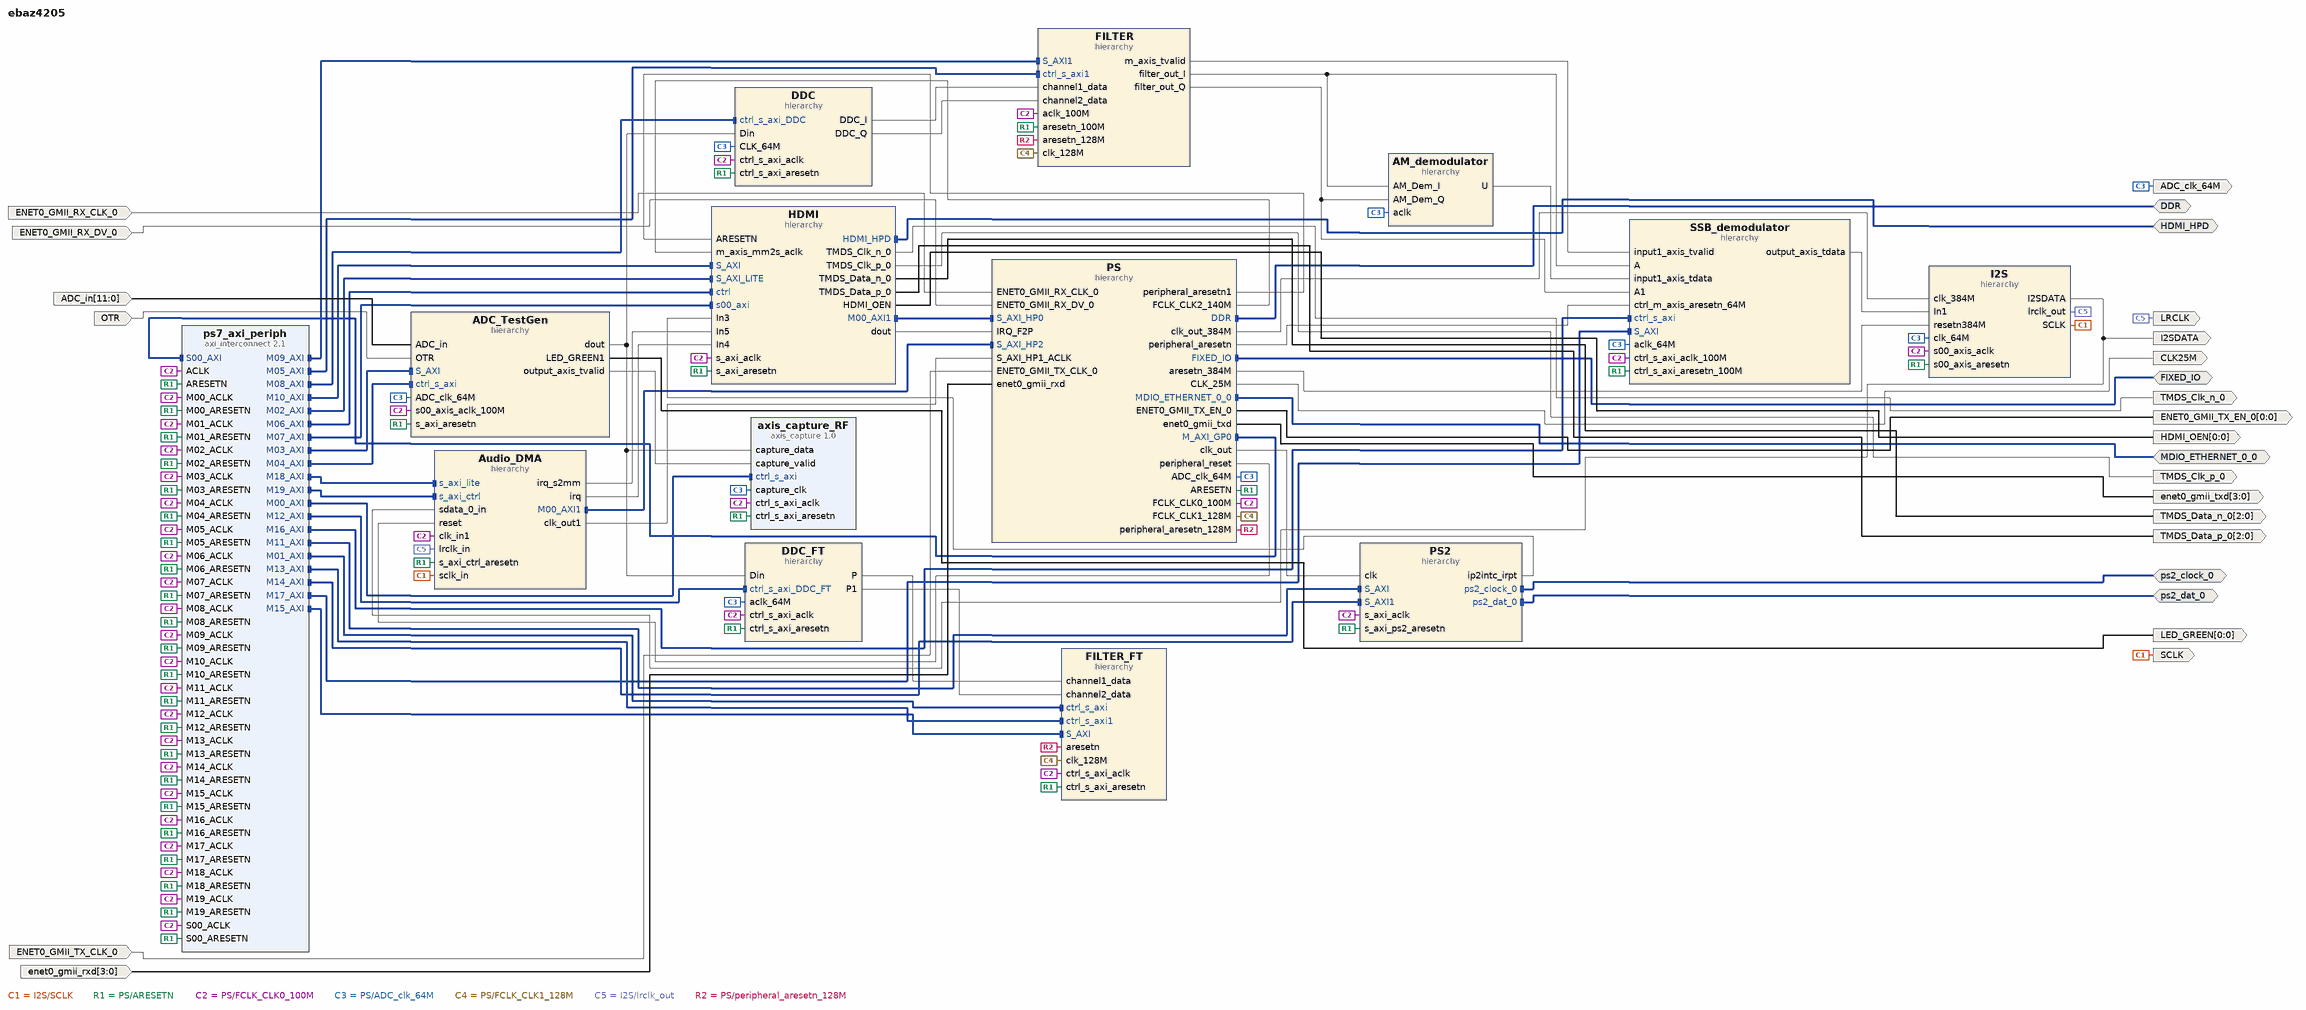
[diagram p0: block diagram of the top level]
# Vivado block design ebaz4205, xc7z010clg400-1, Vivado 2022.2
create_bd_design ebaz4205

create_bd_intf_port -mode Master -vlnv xilinx.com:interface:ddrx_rtl:1.0 DDR
create_bd_intf_port -mode Master -vlnv xilinx.com:display_processing_system7:fixedio_rtl:1.0 FIXED_IO
create_bd_intf_port -mode Master -vlnv xilinx.com:interface:mdio_rtl:1.0 MDIO_ETHERNET_0_0
create_bd_intf_port -mode Master -vlnv xilinx.com:interface:gpio_rtl:1.0 HDMI_HPD
create_bd_intf_port -mode Master -vlnv xilinx.com:interface:gpio_rtl:1.0 ps2_clock_0
create_bd_intf_port -mode Master -vlnv xilinx.com:interface:gpio_rtl:1.0 ps2_dat_0
create_bd_port -dir I -type clk ENET0_GMII_RX_CLK_0
create_bd_port -dir I ENET0_GMII_RX_DV_0
create_bd_port -dir I -type clk ENET0_GMII_TX_CLK_0
create_bd_port -dir O -from 0 -to 0 ENET0_GMII_TX_EN_0
create_bd_port -dir I -from 3 -to 0 enet0_gmii_rxd
create_bd_port -dir O -from 3 -to 0 enet0_gmii_txd
create_bd_port -dir O -type clk CLK25M
set_property -dict {CONFIG.FREQ_HZ 25000000} [get_bd_ports CLK25M]
create_bd_port -dir O -type clk ADC_clk_64M
set_property -dict {CONFIG.FREQ_HZ 64000000} [get_bd_ports ADC_clk_64M]
create_bd_port -dir I -type data OTR
create_bd_port -dir I -from 11 -to 0 -type data ADC_in
create_bd_port -dir O SCLK
create_bd_port -dir O LRCLK
create_bd_port -dir O I2SDATA
create_bd_port -dir O -from 0 -to 0 -type data LED_GREEN
create_bd_port -dir O -from 0 -to 0 HDMI_OEN
create_bd_port -dir O TMDS_Clk_p_0
create_bd_port -dir O TMDS_Clk_n_0
create_bd_port -dir O -from 2 -to 0 TMDS_Data_p_0
create_bd_port -dir O -from 2 -to 0 TMDS_Data_n_0

create_bd_cell -type hier PS
create_bd_cell -type hier ADC_TestGen
create_bd_cell -type hier DDC
create_bd_cell -type hier AM_demodulator
create_bd_cell -type hier FILTER
create_bd_cell -type hier I2S
create_bd_cell -type hier HDMI
create_bd_cell -type ip -vlnv xilinx.com:ip:axi_interconnect:2.1 ps7_axi_periph
set_property -dict [list \
  CONFIG.ENABLE_ADVANCED_OPTIONS 0 \
  CONFIG.NUM_MI 20 \
  CONFIG.NUM_SI 1 \
  CONFIG.STRATEGY 1 \
] [get_bd_cells ps7_axi_periph]
create_bd_cell -type hier DDC_FT
create_bd_cell -type hier FILTER_FT
create_bd_cell -type hier PS2
create_bd_cell -type ip -vlnv xilinx.com:user:axis_capture:1.0 axis_capture_RF
set_property -dict {CONFIG.C_CAPTURE_NUM_WORDS_EXP2 14} [get_bd_cells axis_capture_RF]
create_bd_cell -type hier SSB_demodulator
create_bd_cell -type hier Audio_DMA

# ---- hierarchy /PS ----
current_bd_instance /PS
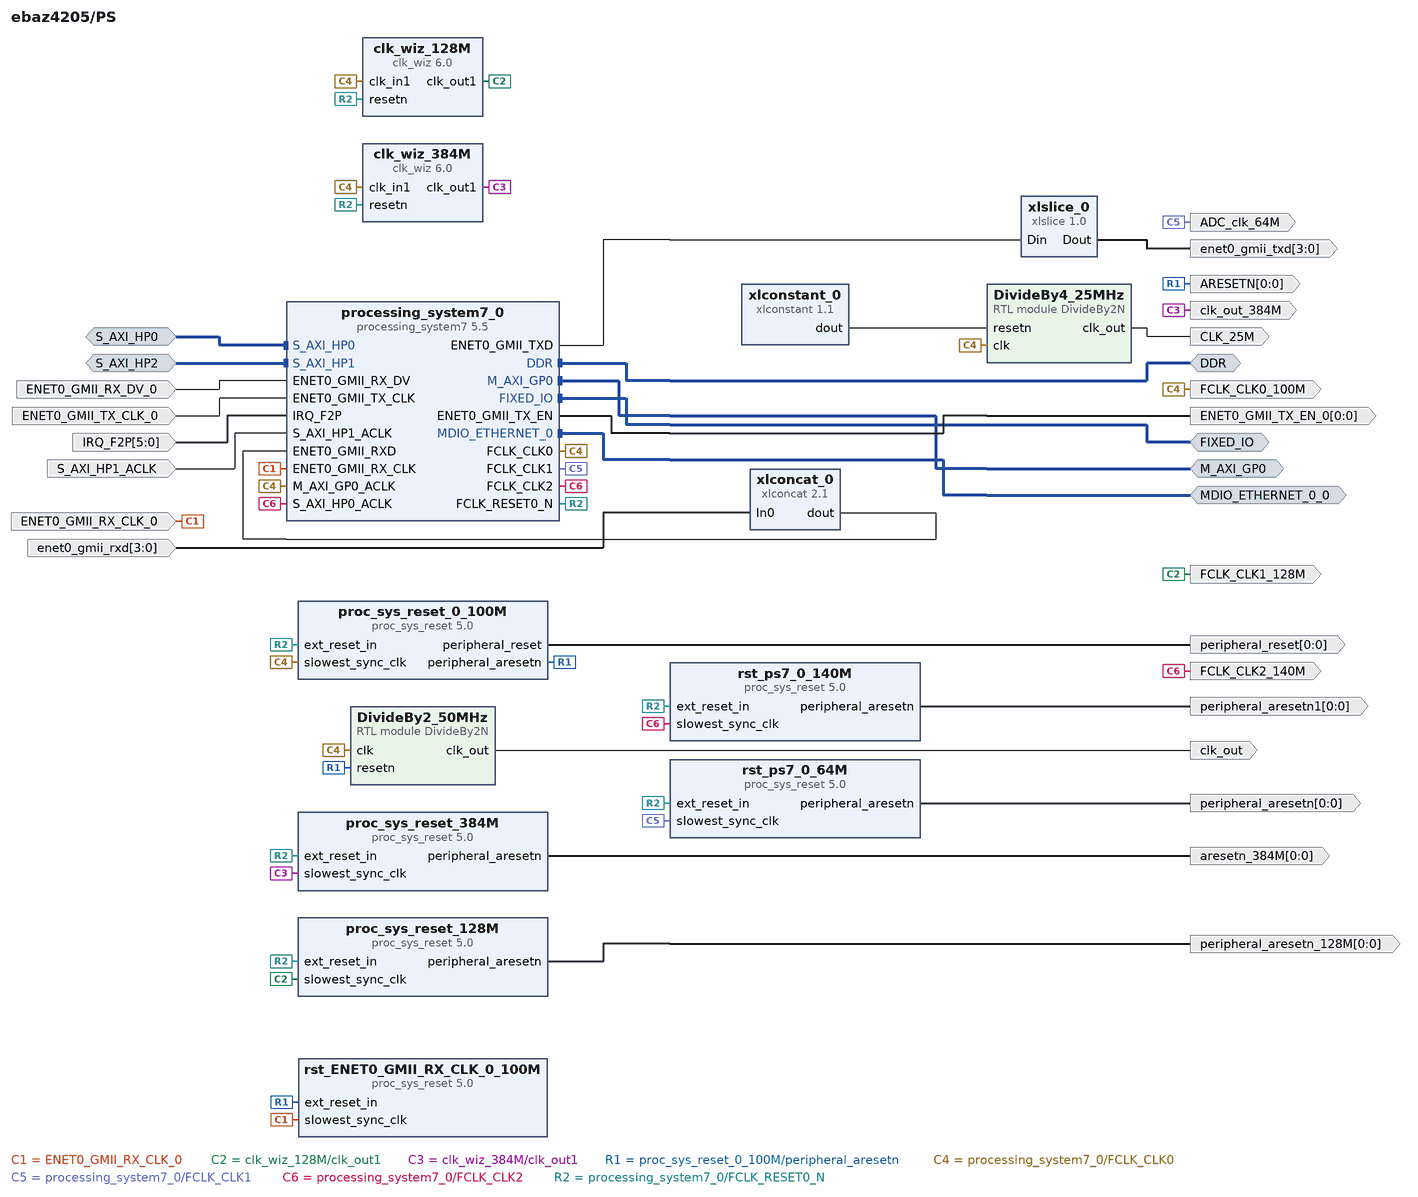
[diagram p1: block diagram inside /PS]
create_bd_intf_pin -mode Master -vlnv xilinx.com:interface:mdio_rtl:1.0 MDIO_ETHERNET_0_0
create_bd_intf_pin -mode Master -vlnv xilinx.com:interface:ddrx_rtl:1.0 DDR
create_bd_intf_pin -mode Master -vlnv xilinx.com:display_processing_system7:fixedio_rtl:1.0 FIXED_IO
create_bd_intf_pin -mode Slave -vlnv xilinx.com:interface:aximm_rtl:1.0 S_AXI_HP0
create_bd_intf_pin -mode Master -vlnv xilinx.com:interface:aximm_rtl:1.0 M_AXI_GP0
create_bd_intf_pin -mode Slave -vlnv xilinx.com:interface:aximm_rtl:1.0 S_AXI_HP2
create_bd_pin -dir O -from 0 -to 0 ENET0_GMII_TX_EN_0
create_bd_pin -dir I -type clk ENET0_GMII_RX_CLK_0
create_bd_pin -dir I ENET0_GMII_RX_DV_0
create_bd_pin -dir I -type clk ENET0_GMII_TX_CLK_0
create_bd_pin -dir O -type clk FCLK_CLK0_100M
create_bd_pin -dir O -type clk CLK_25M
create_bd_pin -dir O -from 3 -to 0 enet0_gmii_txd
create_bd_pin -dir O -from 0 -to 0 -type rst ARESETN
create_bd_pin -dir I -from 3 -to 0 enet0_gmii_rxd
create_bd_pin -dir O -type clk FCLK_CLK1_128M
create_bd_pin -dir O -from 0 -to 0 -type rst peripheral_reset
create_bd_pin -dir O -from 0 -to 0 -type rst peripheral_aresetn_128M
create_bd_pin -dir O -type clk FCLK_CLK2_140M
create_bd_pin -dir O -from 0 -to 0 -type rst peripheral_aresetn1
create_bd_pin -dir I -from 5 -to 0 -type intr IRQ_F2P
create_bd_pin -dir O ADC_clk_64M
create_bd_pin -dir O -from 0 -to 0 -type rst peripheral_aresetn
create_bd_pin -dir O clk_out
create_bd_pin -dir I -type clk S_AXI_HP1_ACLK
create_bd_pin -dir O -type clk clk_out_384M
create_bd_pin -dir O -from 0 -to 0 -type rst aresetn_384M

create_bd_cell -type ip -vlnv xilinx.com:ip:xlslice:1.0 xlslice_0
set_property -dict {CONFIG.DIN_FROM 3 CONFIG.DIN_TO 0 CONFIG.DIN_WIDTH 8 CONFIG.DOUT_WIDTH 4} [get_bd_cells xlslice_0]
create_bd_cell -type ip -vlnv xilinx.com:ip:xlconcat:2.1 xlconcat_0
set_property -dict {CONFIG.IN0_WIDTH 4 CONFIG.IN1_WIDTH 4 CONFIG.NUM_PORTS 2} [get_bd_cells xlconcat_0]
create_bd_cell -type ip -vlnv xilinx.com:ip:xlconstant:1.1 xlconstant_0
create_bd_cell -type module -reference DivideBy2N DivideBy4_25MHz
set_property -dict {CONFIG.N 2 CONFIG.WIDTH 2} [get_bd_cells DivideBy4_25MHz]
create_bd_cell -type module -reference DivideBy2N DivideBy2_50MHz
set_property -dict {CONFIG.N 1 CONFIG.WIDTH 2} [get_bd_cells DivideBy2_50MHz]
create_bd_cell -type ip -vlnv xilinx.com:ip:clk_wiz:6.0 clk_wiz_128M
set_property -dict [list \
  CONFIG.CLKIN1_JITTER_PS 100.0 \
  CONFIG.CLKOUT1_DRIVES BUFG \
  CONFIG.CLKOUT1_JITTER 181.719 \
  CONFIG.CLKOUT1_PHASE_ERROR 320.726 \
  CONFIG.CLKOUT1_REQUESTED_OUT_FREQ 128 \
  CONFIG.CLKOUT2_DRIVES BUFG \
  CONFIG.CLKOUT3_DRIVES BUFG \
  CONFIG.CLKOUT4_DRIVES BUFG \
  CONFIG.CLKOUT5_DRIVES BUFG \
  CONFIG.CLKOUT6_DRIVES BUFG \
  CONFIG.CLKOUT7_DRIVES BUFG \
  CONFIG.MMCM_BANDWIDTH OPTIMIZED \
  CONFIG.MMCM_CLKFBOUT_MULT_F 64 \
  CONFIG.MMCM_CLKIN1_PERIOD 10.000 \
  CONFIG.MMCM_CLKIN2_PERIOD 10.000 \
  CONFIG.MMCM_CLKOUT0_DIVIDE_F 10 \
  CONFIG.MMCM_COMPENSATION ZHOLD \
  CONFIG.MMCM_DIVCLK_DIVIDE 5 \
  CONFIG.PRIMITIVE PLL \
  CONFIG.PRIM_IN_FREQ 100 \
  CONFIG.RESET_PORT resetn \
  CONFIG.RESET_TYPE ACTIVE_LOW \
] [get_bd_cells clk_wiz_128M]
create_bd_cell -type ip -vlnv xilinx.com:ip:proc_sys_reset:5.0 proc_sys_reset_0_100M
create_bd_cell -type ip -vlnv xilinx.com:ip:proc_sys_reset:5.0 proc_sys_reset_128M
create_bd_cell -type ip -vlnv xilinx.com:ip:processing_system7:5.5 processing_system7_0
set_property -dict [list \
  CONFIG.PCW_APU_PERIPHERAL_FREQMHZ 666.666666 \
  CONFIG.PCW_ENET0_ENET0_IO EMIO \
  CONFIG.PCW_ENET0_GRP_MDIO_ENABLE 1 \
  CONFIG.PCW_ENET0_GRP_MDIO_IO EMIO \
  CONFIG.PCW_ENET0_PERIPHERAL_ENABLE 1 \
  CONFIG.PCW_ENET0_PERIPHERAL_FREQMHZ {100 Mbps} \
  CONFIG.PCW_ENET0_RESET_ENABLE 0 \
  CONFIG.PCW_ENET_RESET_ENABLE 1 \
  CONFIG.PCW_ENET_RESET_SELECT {Share reset pin} \
  CONFIG.PCW_EN_CLK1_PORT 1 \
  CONFIG.PCW_EN_CLK2_PORT 1 \
  CONFIG.PCW_EN_CLK3_PORT 1 \
  CONFIG.PCW_FCLK_CLK1_BUF TRUE \
  CONFIG.PCW_FCLK_CLK2_BUF TRUE \
  CONFIG.PCW_FCLK_CLK3_BUF TRUE \
  CONFIG.PCW_FPGA0_PERIPHERAL_FREQMHZ 100 \
  CONFIG.PCW_FPGA1_PERIPHERAL_FREQMHZ 64 \
  CONFIG.PCW_FPGA2_PERIPHERAL_FREQMHZ 142 \
  CONFIG.PCW_FPGA3_PERIPHERAL_FREQMHZ 25 \
  CONFIG.PCW_FPGA_FCLK1_ENABLE 1 \
  CONFIG.PCW_FPGA_FCLK2_ENABLE 1 \
  CONFIG.PCW_FPGA_FCLK3_ENABLE 1 \
  CONFIG.PCW_GPIO_EMIO_GPIO_ENABLE 1 \
  CONFIG.PCW_GPIO_EMIO_GPIO_IO 64 \
  CONFIG.PCW_GPIO_MIO_GPIO_ENABLE 1 \
  CONFIG.PCW_GPIO_MIO_GPIO_IO MIO \
  CONFIG.PCW_I2C_RESET_ENABLE 1 \
  CONFIG.PCW_IRQ_F2P_INTR 1 \
  CONFIG.PCW_NAND_NAND_IO {MIO 0 2.. 14} \
  CONFIG.PCW_NAND_PERIPHERAL_ENABLE 1 \
  CONFIG.PCW_PERIPHERAL_BOARD_PRESET part0 \
  CONFIG.PCW_PRESET_BANK1_VOLTAGE {LVCMOS 3.3V} \
  CONFIG.PCW_SD0_GRP_CD_ENABLE 1 \
  CONFIG.PCW_SD0_GRP_CD_IO {MIO 34} \
  CONFIG.PCW_SD0_GRP_WP_ENABLE 0 \
  CONFIG.PCW_SD0_PERIPHERAL_ENABLE 1 \
  CONFIG.PCW_SD0_SD0_IO {MIO 40 .. 45} \
  CONFIG.PCW_SDIO_PERIPHERAL_FREQMHZ 25 \
  CONFIG.PCW_UART1_PERIPHERAL_ENABLE 1 \
  CONFIG.PCW_UART1_UART1_IO {MIO 24 .. 25} \
  CONFIG.PCW_UART_PERIPHERAL_FREQMHZ 100 \
  CONFIG.PCW_UIPARAM_DDR_BUS_WIDTH {16 Bit} \
  CONFIG.PCW_UIPARAM_DDR_FREQ_MHZ 533.333333 \
  CONFIG.PCW_UIPARAM_DDR_PARTNO {MT41K128M16 JT-125} \
  CONFIG.PCW_USB0_PERIPHERAL_ENABLE 0 \
  CONFIG.PCW_USB_RESET_ENABLE 1 \
  CONFIG.PCW_USE_FABRIC_INTERRUPT 1 \
  CONFIG.PCW_USE_S_AXI_HP0 1 \
  CONFIG.PCW_USE_S_AXI_HP1 1 \
  CONFIG.preset None \
] [get_bd_cells processing_system7_0]
# 502 more settings of processing_system7_0 are not shown: defaults, MIO pin electricals, DDR timing, and values the tool derives
create_bd_cell -type ip -vlnv xilinx.com:ip:proc_sys_reset:5.0 rst_ENET0_GMII_RX_CLK_0_100M
create_bd_cell -type ip -vlnv xilinx.com:ip:proc_sys_reset:5.0 rst_ps7_0_140M
create_bd_cell -type ip -vlnv xilinx.com:ip:proc_sys_reset:5.0 rst_ps7_0_64M
create_bd_cell -type ip -vlnv xilinx.com:ip:clk_wiz:6.0 clk_wiz_384M
set_property -dict [list \
  CONFIG.CLKIN1_JITTER_PS 100.0 \
  CONFIG.CLKOUT1_DRIVES BUFG \
  CONFIG.CLKOUT1_JITTER 208.354 \
  CONFIG.CLKOUT1_PHASE_ERROR 301.601 \
  CONFIG.CLKOUT1_REQUESTED_OUT_FREQ 384 \
  CONFIG.CLKOUT2_DRIVES BUFG \
  CONFIG.CLKOUT2_JITTER 374.625 \
  CONFIG.CLKOUT2_PHASE_ERROR 250.856 \
  CONFIG.CLKOUT2_REQUESTED_OUT_FREQ 100.000 \
  CONFIG.CLKOUT2_USED false \
  CONFIG.CLKOUT3_DRIVES BUFG \
  CONFIG.CLKOUT4_DRIVES BUFG \
  CONFIG.CLKOUT5_DRIVES BUFG \
  CONFIG.CLKOUT6_DRIVES BUFG \
  CONFIG.CLKOUT7_DRIVES BUFG \
  CONFIG.FEEDBACK_SOURCE FDBK_AUTO \
  CONFIG.MMCM_BANDWIDTH OPTIMIZED \
  CONFIG.MMCM_CLKFBOUT_MULT_F 48.000 \
  CONFIG.MMCM_CLKIN1_PERIOD 10.000 \
  CONFIG.MMCM_CLKIN2_PERIOD 10.000 \
  CONFIG.MMCM_CLKOUT0_DIVIDE_F 2.500 \
  CONFIG.MMCM_CLKOUT1_DIVIDE 1 \
  CONFIG.MMCM_COMPENSATION ZHOLD \
  CONFIG.MMCM_DIVCLK_DIVIDE 5 \
  CONFIG.NUM_OUT_CLKS 1 \
  CONFIG.PLL_CLKIN_PERIOD 15.625 \
  CONFIG.PRIMITIVE MMCM \
  CONFIG.PRIM_IN_FREQ 100 \
  CONFIG.PRIM_SOURCE Single_ended_clock_capable_pin \
  CONFIG.RESET_PORT resetn \
  CONFIG.RESET_TYPE ACTIVE_LOW \
  CONFIG.SECONDARY_SOURCE Single_ended_clock_capable_pin \
  CONFIG.USE_LOCKED true \
  CONFIG.USE_PHASE_ALIGNMENT true \
] [get_bd_cells clk_wiz_384M]
create_bd_cell -type ip -vlnv xilinx.com:ip:proc_sys_reset:5.0 proc_sys_reset_384M

# ---- hierarchy /ADC_TestGen ----
current_bd_instance /ADC_TestGen
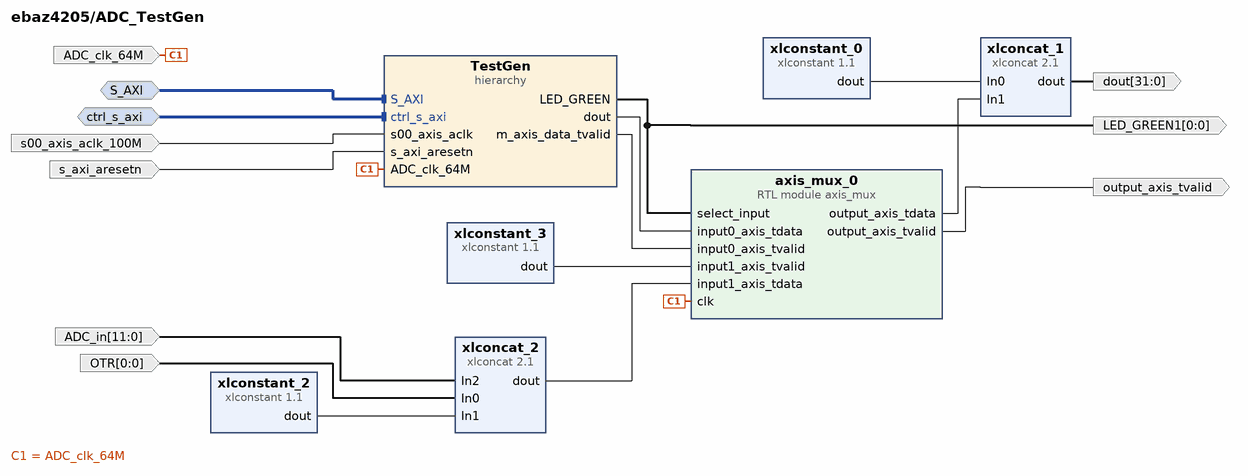
[diagram p2: block diagram inside /ADC_TestGen]
create_bd_intf_pin -mode Slave -vlnv xilinx.com:interface:aximm_rtl:1.0 S_AXI
create_bd_intf_pin -mode Slave -vlnv xilinx.com:interface:aximm_rtl:1.0 ctrl_s_axi
create_bd_pin -dir O -from 31 -to 0 dout
create_bd_pin -dir O output_axis_tvalid
create_bd_pin -dir I -type clk ADC_clk_64M
create_bd_pin -dir I -from 0 -to 0 -type data OTR
create_bd_pin -dir I -from 11 -to 0 -type data ADC_in
create_bd_pin -dir I -type clk s00_axis_aclk_100M
create_bd_pin -dir I -type rst s_axi_aresetn
create_bd_pin -dir O -from 0 -to 0 LED_GREEN1

create_bd_cell -type ip -vlnv xilinx.com:ip:xlconcat:2.1 xlconcat_1
set_property -dict {CONFIG.IN0_WIDTH 16 CONFIG.IN1_WIDTH 16} [get_bd_cells xlconcat_1]
create_bd_cell -type ip -vlnv xilinx.com:ip:xlconcat:2.1 xlconcat_2
set_property -dict {CONFIG.IN0_WIDTH 1 CONFIG.IN1_WIDTH 3 CONFIG.IN2_WIDTH 12 CONFIG.NUM_PORTS 3} [get_bd_cells xlconcat_2]
create_bd_cell -type hier TestGen
create_bd_cell -type ip -vlnv xilinx.com:ip:xlconstant:1.1 xlconstant_0
set_property -dict {CONFIG.CONST_VAL 0 CONFIG.CONST_WIDTH 16} [get_bd_cells xlconstant_0]
create_bd_cell -type ip -vlnv xilinx.com:ip:xlconstant:1.1 xlconstant_3
set_property -dict {CONFIG.CONST_VAL 1 CONFIG.CONST_WIDTH 1} [get_bd_cells xlconstant_3]
create_bd_cell -type ip -vlnv xilinx.com:ip:xlconstant:1.1 xlconstant_2
set_property -dict {CONFIG.CONST_VAL b000 CONFIG.CONST_WIDTH 3} [get_bd_cells xlconstant_2]
create_bd_cell -type module -reference axis_mux axis_mux_0

# ---- hierarchy /ADC_TestGen/TestGen ----
current_bd_instance /ADC_TestGen/TestGen
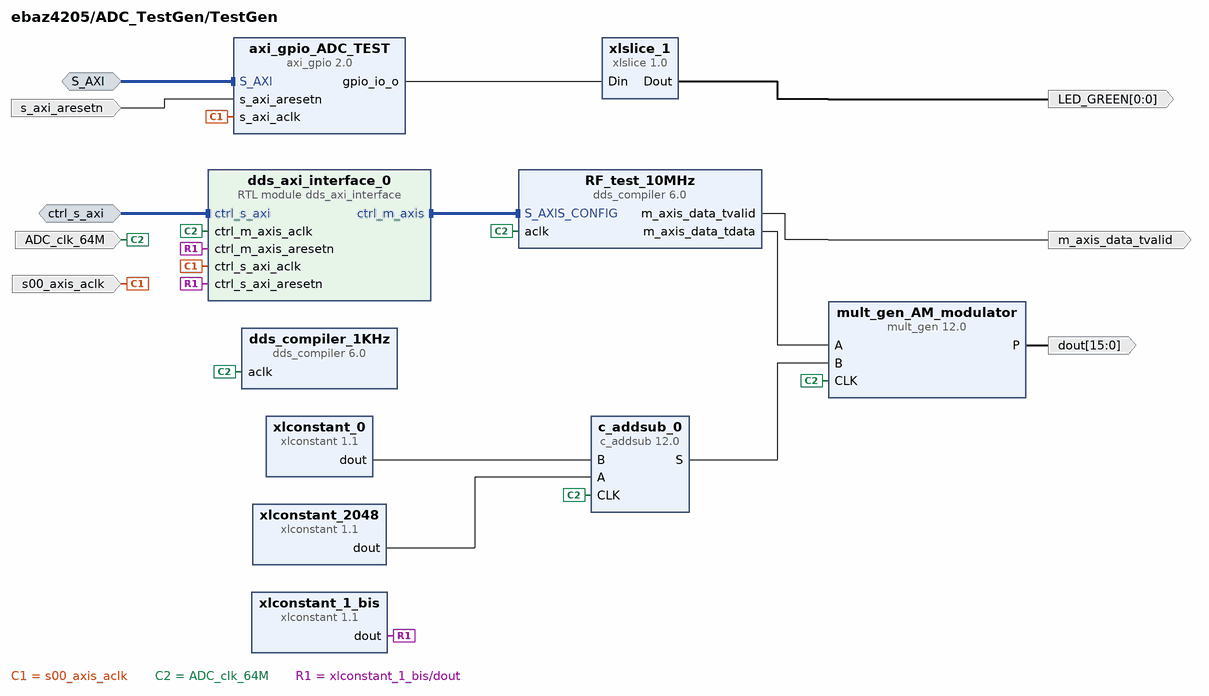
[diagram p3: block diagram inside /ADC_TestGen/TestGen]
create_bd_intf_pin -mode Slave -vlnv xilinx.com:interface:aximm_rtl:1.0 S_AXI
create_bd_intf_pin -mode Slave -vlnv xilinx.com:interface:aximm_rtl:1.0 ctrl_s_axi
create_bd_pin -dir I -type clk ADC_clk_64M
create_bd_pin -dir O m_axis_data_tvalid
create_bd_pin -dir I -type clk s00_axis_aclk
create_bd_pin -dir O -from 15 -to 0 dout
create_bd_pin -dir I -type rst s_axi_aresetn
create_bd_pin -dir O -from 0 -to 0 LED_GREEN

create_bd_cell -type ip -vlnv xilinx.com:ip:c_addsub:12.0 c_addsub_0
set_property -dict [list \
  CONFIG.A_Width 16 \
  CONFIG.B_Value 0000000000000000 \
  CONFIG.B_Width 16 \
  CONFIG.CE false \
  CONFIG.Latency 1 \
  CONFIG.Out_Width 16 \
] [get_bd_cells c_addsub_0]
create_bd_cell -type ip -vlnv xilinx.com:ip:xlslice:1.0 xlslice_1
create_bd_cell -type ip -vlnv xilinx.com:ip:dds_compiler:6.0 RF_test_10MHz
set_property -dict [list \
  CONFIG.DATA_Has_TLAST Not_Required \
  CONFIG.DDS_Clock_Rate 64 \
  CONFIG.Frequency_Resolution 1 \
  CONFIG.Has_Phase_Out false \
  CONFIG.Latency 7 \
  CONFIG.M_DATA_Has_TUSER Not_Required \
  CONFIG.Noise_Shaping Auto \
  CONFIG.OUTPUT_FORM Twos_Complement \
  CONFIG.Output_Frequency1 10 \
  CONFIG.Output_Selection Sine \
  CONFIG.Output_Width 12 \
  CONFIG.PINC1 101000000000000000000000 \
  CONFIG.Parameter_Entry System_Parameters \
  CONFIG.Phase_Increment Programmable \
  CONFIG.Phase_Width 26 \
  CONFIG.Phase_offset None \
  CONFIG.S_PHASE_Has_TUSER Not_Required \
  CONFIG.Spurious_Free_Dynamic_Range 70 \
] [get_bd_cells RF_test_10MHz]
create_bd_cell -type ip -vlnv xilinx.com:ip:dds_compiler:6.0 dds_compiler_1KHz
set_property -dict [list \
  CONFIG.Amplitude_Mode Full_Range \
  CONFIG.DDS_Clock_Rate 64 \
  CONFIG.Frequency_Resolution 0.4 \
  CONFIG.Has_Phase_Out false \
  CONFIG.Latency 7 \
  CONFIG.M_DATA_Has_TUSER Not_Required \
  CONFIG.Noise_Shaping Auto \
  CONFIG.Output_Frequency1 0.001 \
  CONFIG.Output_Selection Sine \
  CONFIG.Output_Width 12 \
  CONFIG.PINC1 1000001100010 \
  CONFIG.Parameter_Entry System_Parameters \
  CONFIG.Phase_Width 28 \
  CONFIG.Spurious_Free_Dynamic_Range 70 \
] [get_bd_cells dds_compiler_1KHz]
create_bd_cell -type ip -vlnv xilinx.com:ip:mult_gen:12.0 mult_gen_AM_modulator
set_property -dict [list \
  CONFIG.OptGoal Area \
  CONFIG.OutputWidthHigh 24 \
  CONFIG.OutputWidthLow 9 \
  CONFIG.PortAWidth 16 \
  CONFIG.PortBWidth 16 \
  CONFIG.Use_Custom_Output_Width true \
] [get_bd_cells mult_gen_AM_modulator]
create_bd_cell -type ip -vlnv xilinx.com:ip:xlconstant:1.1 xlconstant_1_bis
create_bd_cell -type ip -vlnv xilinx.com:ip:xlconstant:1.1 xlconstant_2048
set_property -dict {CONFIG.CONST_VAL 512 CONFIG.CONST_WIDTH 16} [get_bd_cells xlconstant_2048]
create_bd_cell -type module -reference dds_axi_interface dds_axi_interface_0
create_bd_cell -type ip -vlnv xilinx.com:ip:xlconstant:1.1 xlconstant_0
set_property -dict {CONFIG.CONST_VAL 0 CONFIG.CONST_WIDTH 16} [get_bd_cells xlconstant_0]
create_bd_cell -type ip -vlnv xilinx.com:ip:axi_gpio:2.0 axi_gpio_ADC_TEST
set_property -dict [list \
  CONFIG.C_ALL_OUTPUTS 1 \
  CONFIG.C_DOUT_DEFAULT 0x00000000 \
  CONFIG.C_GPIO_WIDTH 32 \
  CONFIG.C_IS_DUAL 0 \
] [get_bd_cells axi_gpio_ADC_TEST]

# ---- hierarchy /DDC ----
current_bd_instance /DDC
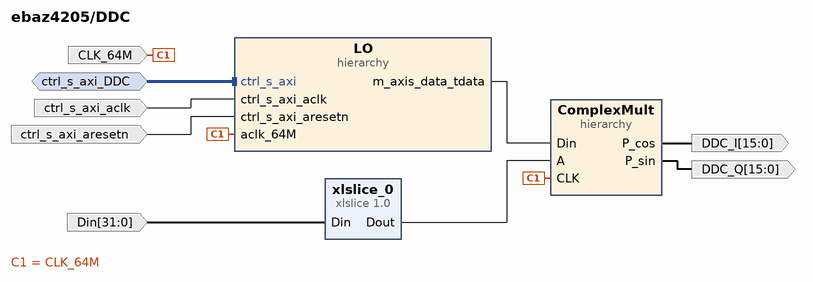
[diagram p4: block diagram inside /DDC]
create_bd_intf_pin -mode Slave -vlnv xilinx.com:interface:aximm_rtl:1.0 ctrl_s_axi_DDC
create_bd_pin -dir I -type clk CLK_64M
create_bd_pin -dir O -from 15 -to 0 -type data DDC_I
create_bd_pin -dir O -from 15 -to 0 -type data DDC_Q
create_bd_pin -dir I -from 31 -to 0 Din
create_bd_pin -dir I -type clk ctrl_s_axi_aclk
create_bd_pin -dir I -type rst ctrl_s_axi_aresetn

create_bd_cell -type hier LO
create_bd_cell -type hier ComplexMult
create_bd_cell -type ip -vlnv xilinx.com:ip:xlslice:1.0 xlslice_0
set_property -dict {CONFIG.DIN_FROM 31 CONFIG.DIN_TO 20 CONFIG.DOUT_WIDTH 12} [get_bd_cells xlslice_0]

# ---- hierarchy /DDC/LO ----
current_bd_instance /DDC/LO
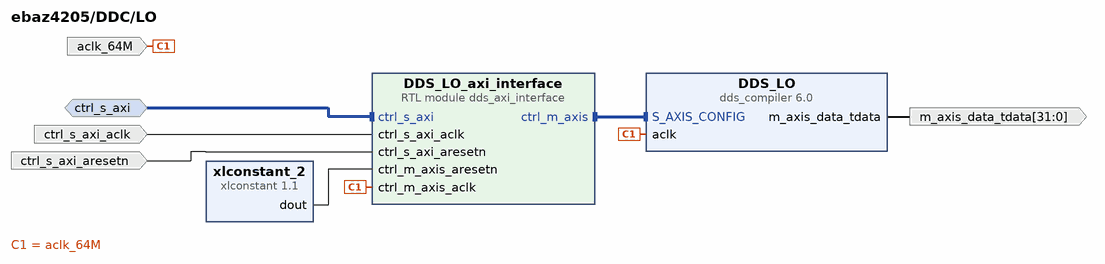
[diagram p5: block diagram inside /DDC/LO]
create_bd_intf_pin -mode Slave -vlnv xilinx.com:interface:aximm_rtl:1.0 ctrl_s_axi
create_bd_pin -dir I -type clk aclk_64M
create_bd_pin -dir O -from 31 -to 0 m_axis_data_tdata
create_bd_pin -dir I -type clk ctrl_s_axi_aclk
create_bd_pin -dir I -type rst ctrl_s_axi_aresetn

create_bd_cell -type ip -vlnv xilinx.com:ip:dds_compiler:6.0 DDS_LO
set_property -dict [list \
  CONFIG.DATA_Has_TLAST Not_Required \
  CONFIG.DDS_Clock_Rate 64 \
  CONFIG.Frequency_Resolution 1 \
  CONFIG.Has_Phase_Out false \
  CONFIG.Latency 8 \
  CONFIG.M_DATA_Has_TUSER Not_Required \
  CONFIG.Noise_Shaping Auto \
  CONFIG.OUTPUT_FORM Twos_Complement \
  CONFIG.Output_Frequency1 10.010 \
  CONFIG.Output_Selection Sine_and_Cosine \
  CONFIG.Output_Width 16 \
  CONFIG.PINC1 101000000010100011110101 \
  CONFIG.Parameter_Entry System_Parameters \
  CONFIG.Phase_Increment Programmable \
  CONFIG.Phase_Width 26 \
  CONFIG.Phase_offset None \
  CONFIG.S_PHASE_Has_TUSER Not_Required \
  CONFIG.Spurious_Free_Dynamic_Range 95 \
] [get_bd_cells DDS_LO]
create_bd_cell -type ip -vlnv xilinx.com:ip:xlconstant:1.1 xlconstant_2
create_bd_cell -type module -reference dds_axi_interface DDS_LO_axi_interface

# ---- hierarchy /DDC/ComplexMult ----
current_bd_instance /DDC/ComplexMult
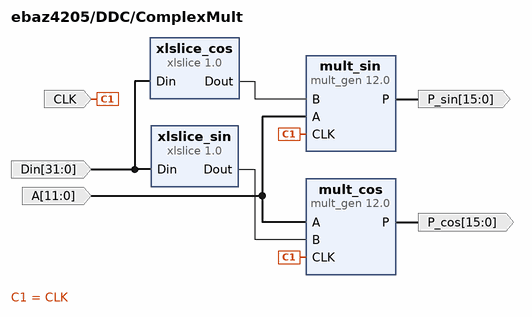
[diagram p6: block diagram inside /DDC/ComplexMult]
create_bd_pin -dir I -from 31 -to 0 Din
create_bd_pin -dir I -type clk CLK
create_bd_pin -dir I -from 11 -to 0 -type data A
create_bd_pin -dir O -from 15 -to 0 -type data P_cos
create_bd_pin -dir O -from 15 -to 0 -type data P_sin

create_bd_cell -type ip -vlnv xilinx.com:ip:xlslice:1.0 xlslice_sin
set_property -dict {CONFIG.DIN_FROM 31 CONFIG.DIN_TO 16 CONFIG.DOUT_WIDTH 16} [get_bd_cells xlslice_sin]
create_bd_cell -type ip -vlnv xilinx.com:ip:xlslice:1.0 xlslice_cos
set_property -dict {CONFIG.DIN_FROM 15 CONFIG.DIN_TO 0 CONFIG.DOUT_WIDTH 16} [get_bd_cells xlslice_cos]
create_bd_cell -type ip -vlnv xilinx.com:ip:mult_gen:12.0 mult_sin
set_property -dict [list \
  CONFIG.OutputWidthHigh 26 \
  CONFIG.OutputWidthLow 11 \
  CONFIG.PortAWidth 12 \
  CONFIG.PortBWidth 16 \
  CONFIG.Use_Custom_Output_Width true \
] [get_bd_cells mult_sin]
create_bd_cell -type ip -vlnv xilinx.com:ip:mult_gen:12.0 mult_cos
set_property -dict [list \
  CONFIG.MultType Parallel_Multiplier \
  CONFIG.OutputWidthHigh 26 \
  CONFIG.OutputWidthLow 11 \
  CONFIG.PortAWidth 12 \
  CONFIG.PortBWidth 16 \
  CONFIG.Use_Custom_Output_Width true \
] [get_bd_cells mult_cos]

# ---- hierarchy /AM_demodulator ----
current_bd_instance /AM_demodulator
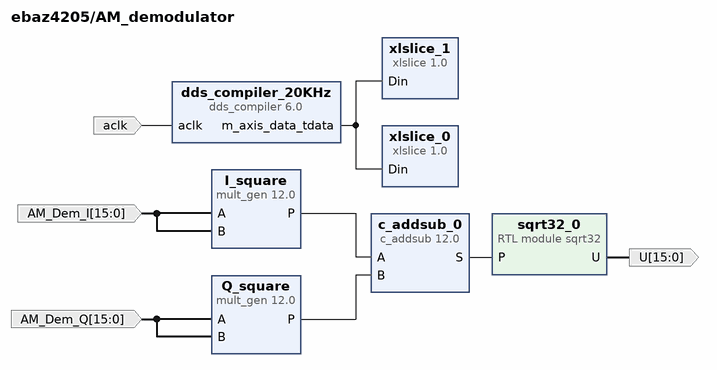
[diagram p7: block diagram inside /AM_demodulator]
create_bd_pin -dir I -from 15 -to 0 -type data AM_Dem_I
create_bd_pin -dir I -from 15 -to 0 -type data AM_Dem_Q
create_bd_pin -dir O -from 15 -to 0 U
create_bd_pin -dir I -type clk aclk

create_bd_cell -type ip -vlnv xilinx.com:ip:c_addsub:12.0 c_addsub_0
set_property -dict [list \
  CONFIG.A_Type Signed \
  CONFIG.A_Width 32 \
  CONFIG.B_Type Signed \
  CONFIG.B_Value 00000000000000000000000000000000 \
  CONFIG.B_Width 32 \
  CONFIG.CE false \
  CONFIG.Latency 0 \
  CONFIG.Out_Width 32 \
] [get_bd_cells c_addsub_0]
create_bd_cell -type ip -vlnv xilinx.com:ip:mult_gen:12.0 I_square
set_property -dict [list \
  CONFIG.Multiplier_Construction Use_Mults \
  CONFIG.OptGoal Area \
  CONFIG.PipeStages 0 \
  CONFIG.PortAType Signed \
  CONFIG.PortAWidth 16 \
  CONFIG.PortBWidth 16 \
] [get_bd_cells I_square]
create_bd_cell -type ip -vlnv xilinx.com:ip:mult_gen:12.0 Q_square
set_property -dict [list \
  CONFIG.MultType Parallel_Multiplier \
  CONFIG.Multiplier_Construction Use_Mults \
  CONFIG.OptGoal Area \
  CONFIG.PipeStages 0 \
  CONFIG.PortAType Signed \
  CONFIG.PortAWidth 16 \
  CONFIG.PortBType Signed \
  CONFIG.PortBWidth 16 \
] [get_bd_cells Q_square]
create_bd_cell -type module -reference sqrt32 sqrt32_0
create_bd_cell -type ip -vlnv xilinx.com:ip:dds_compiler:6.0 dds_compiler_20KHz
set_property -dict [list \
  CONFIG.DDS_Clock_Rate 64 \
  CONFIG.Frequency_Resolution 0.4 \
  CONFIG.Latency 8 \
  CONFIG.Noise_Shaping Auto \
  CONFIG.Output_Frequency1 0.02 \
  CONFIG.Output_Width 16 \
  CONFIG.PINC1 10100011110101110 \
  CONFIG.Phase_Width 28 \
  CONFIG.Spurious_Free_Dynamic_Range 95 \
] [get_bd_cells dds_compiler_20KHz]
create_bd_cell -type ip -vlnv xilinx.com:ip:xlslice:1.0 xlslice_0
set_property -dict {CONFIG.DIN_FROM 15} [get_bd_cells xlslice_0]
create_bd_cell -type ip -vlnv xilinx.com:ip:xlslice:1.0 xlslice_1
set_property -dict {CONFIG.DIN_FROM 31 CONFIG.DIN_TO 16} [get_bd_cells xlslice_1]

# ---- hierarchy /FILTER ----
current_bd_instance /FILTER
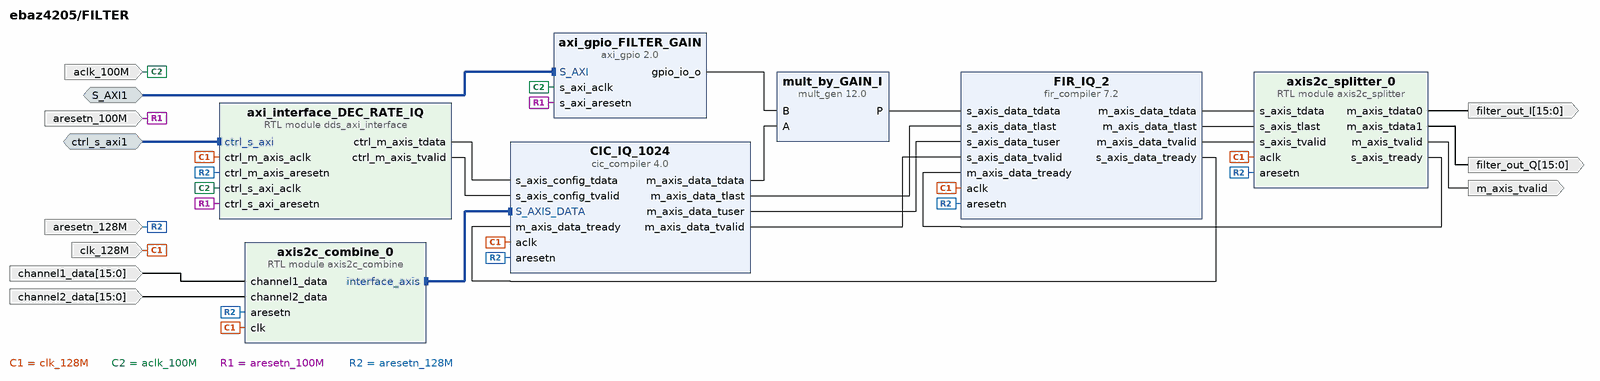
[diagram p8: block diagram inside /FILTER]
create_bd_intf_pin -mode Slave -vlnv xilinx.com:interface:aximm_rtl:1.0 S_AXI1
create_bd_intf_pin -mode Slave -vlnv xilinx.com:interface:aximm_rtl:1.0 ctrl_s_axi1
create_bd_pin -dir I -type rst aresetn_128M
create_bd_pin -dir O -from 15 -to 0 filter_out_I
create_bd_pin -dir O -from 15 -to 0 filter_out_Q
create_bd_pin -dir I -type clk aclk_100M
create_bd_pin -dir I -type rst aresetn_100M
create_bd_pin -dir I -from 15 -to 0 channel1_data
create_bd_pin -dir I -from 15 -to 0 channel2_data
create_bd_pin -dir I -type clk clk_128M
create_bd_pin -dir O m_axis_tvalid

create_bd_cell -type ip -vlnv xilinx.com:ip:cic_compiler:4.0 CIC_IQ_1024
set_property -dict [list \
  CONFIG.Clock_Frequency 128.0000000 \
  CONFIG.Filter_Type Decimation \
  CONFIG.Fixed_Or_Initial_Rate 256 \
  CONFIG.HAS_ARESETN true \
  CONFIG.HAS_DOUT_TREADY true \
  CONFIG.Input_Data_Width 16 \
  CONFIG.Input_Sample_Frequency 64 \
  CONFIG.Maximum_Rate 8192 \
  CONFIG.Minimum_Rate 4 \
  CONFIG.Number_Of_Channels 2 \
  CONFIG.Number_Of_Stages 6 \
  CONFIG.Output_Data_Width 16 \
  CONFIG.Quantization Truncation \
  CONFIG.Response_Magnitude Normalized \
  CONFIG.SamplePeriod 1 \
  CONFIG.Sample_Rate_Changes Programmable \
  CONFIG.Use_Xtreme_DSP_Slice false \
] [get_bd_cells CIC_IQ_1024]
create_bd_cell -type ip -vlnv xilinx.com:ip:fir_compiler:7.2 FIR_IQ_2
set_property -dict [list \
  CONFIG.BestPrecision false \
  CONFIG.Channel_Sequence Basic \
  CONFIG.Clock_Frequency 128 \
  CONFIG.CoefficientSource COE_File \
  CONFIG.Coefficient_File ../../../../../../matlab/mycoefile.coe \
  CONFIG.Coefficient_Fractional_Bits 0 \
  CONFIG.Coefficient_Reload false \
  CONFIG.Coefficient_Sets 1 \
  CONFIG.Coefficient_Sign Signed \
  CONFIG.Coefficient_Structure Symmetric \
  CONFIG.Coefficient_Width 16 \
  CONFIG.ColumnConfig 28 \
  CONFIG.DATA_Has_TLAST Vector_Framing \
  CONFIG.Data_Fractional_Bits 0 \
  CONFIG.Data_Width 16 \
  CONFIG.Decimation_Rate 2 \
  CONFIG.Filter_Architecture Systolic_Multiply_Accumulate \
  CONFIG.Filter_Type Decimation \
  CONFIG.Has_ARESETn true \
  CONFIG.Interpolation_Rate 1 \
  CONFIG.M_DATA_Has_TREADY true \
  CONFIG.M_DATA_Has_TUSER Not_Required \
  CONFIG.Number_Channels 2 \
  CONFIG.Number_Paths 1 \
  CONFIG.Output_Rounding_Mode Truncate_LSBs \
  CONFIG.Output_Width 16 \
  CONFIG.Quantization Integer_Coefficients \
  CONFIG.RateSpecification Frequency_Specification \
  CONFIG.Reset_Data_Vector false \
  CONFIG.S_DATA_Has_FIFO true \
  CONFIG.S_DATA_Has_TUSER Chan_ID_Field \
  CONFIG.SamplePeriod 1 \
  CONFIG.Sample_Frequency 64 \
  CONFIG.Select_Pattern All \
  CONFIG.Zero_Pack_Factor 1 \
] [get_bd_cells FIR_IQ_2]
create_bd_cell -type ip -vlnv xilinx.com:ip:mult_gen:12.0 mult_by_GAIN_I
set_property -dict [list \
  CONFIG.MultType Parallel_Multiplier \
  CONFIG.Multiplier_Construction Use_Mults \
  CONFIG.OptGoal Area \
  CONFIG.OutputWidthHigh 15 \
  CONFIG.PipeStages 0 \
  CONFIG.PortAWidth 16 \
  CONFIG.PortBWidth 16 \
  CONFIG.Use_Custom_Output_Width true \
] [get_bd_cells mult_by_GAIN_I]
create_bd_cell -type module -reference dds_axi_interface axi_interface_DEC_RATE_IQ
set_property -dict [list \
  CONFIG.C_CTRL_M_AXIS_TDATA_WIDTH 16 \
  CONFIG.C_CTRL_M_AXIS_TDATA_WIDTH_INTERN 32 \
  CONFIG.C_CTRL_S_AXI_DATA_WIDTH 32 \
] [get_bd_cells axi_interface_DEC_RATE_IQ]
create_bd_cell -type module -reference axis2c_combine axis2c_combine_0
create_bd_cell -type ip -vlnv xilinx.com:ip:axi_gpio:2.0 axi_gpio_FILTER_GAIN
set_property -dict [list \
  CONFIG.C_ALL_OUTPUTS 1 \
  CONFIG.C_DOUT_DEFAULT 0x00000001 \
  CONFIG.C_GPIO_WIDTH 16 \
] [get_bd_cells axi_gpio_FILTER_GAIN]
create_bd_cell -type module -reference axis2c_splitter axis2c_splitter_0

# ---- hierarchy /I2S ----
current_bd_instance /I2S
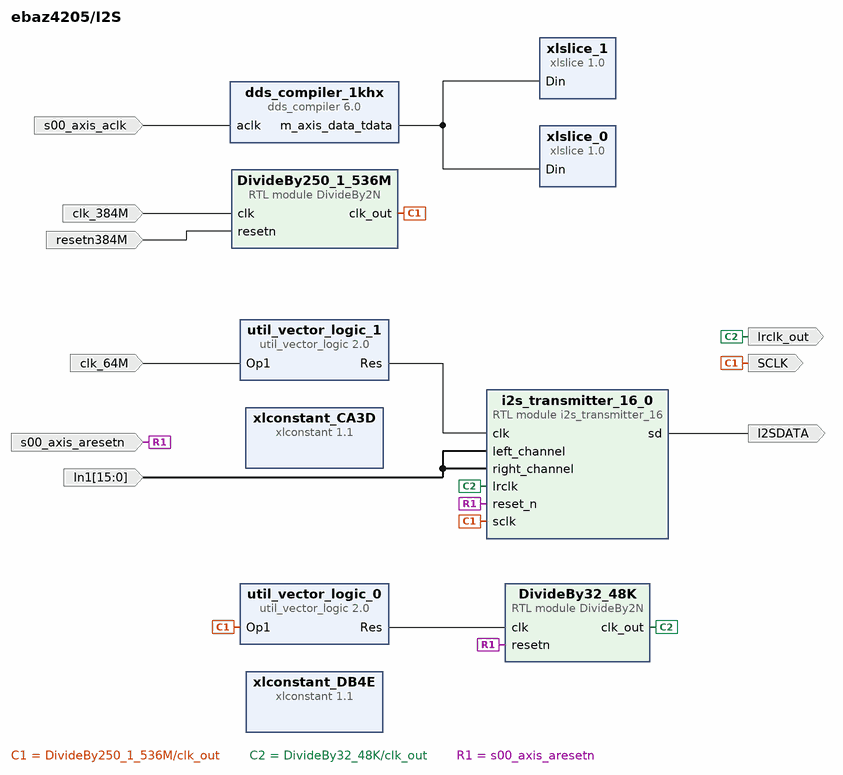
[diagram p9: block diagram inside /I2S]
create_bd_pin -dir I -from 15 -to 0 In1
create_bd_pin -dir I -type clk s00_axis_aclk
create_bd_pin -dir I -type rst s00_axis_aresetn
create_bd_pin -dir O SCLK
create_bd_pin -dir O I2SDATA
create_bd_pin -dir O lrclk_out
create_bd_pin -dir I -type clk clk_64M
create_bd_pin -dir I -type clk clk_384M
create_bd_pin -dir I -type rst resetn384M

create_bd_cell -type module -reference DivideBy2N DivideBy250_1_536M
set_property -dict {CONFIG.N 125 CONFIG.WIDTH 8} [get_bd_cells DivideBy250_1_536M]
create_bd_cell -type ip -vlnv xilinx.com:ip:xlconstant:1.1 xlconstant_DB4E
set_property -dict {CONFIG.CONST_VAL 0xDB4E CONFIG.CONST_WIDTH 16} [get_bd_cells xlconstant_DB4E]
create_bd_cell -type ip -vlnv xilinx.com:ip:xlconstant:1.1 xlconstant_CA3D
set_property -dict {CONFIG.CONST_VAL 0xCA3D CONFIG.CONST_WIDTH 16} [get_bd_cells xlconstant_CA3D]
create_bd_cell -type module -reference DivideBy2N DivideBy32_48K
set_property -dict {CONFIG.N 16 CONFIG.WIDTH 8} [get_bd_cells DivideBy32_48K]
create_bd_cell -type ip -vlnv xilinx.com:ip:util_vector_logic:2.0 util_vector_logic_0
set_property -dict {CONFIG.C_OPERATION not CONFIG.C_SIZE 1} [get_bd_cells util_vector_logic_0]
create_bd_cell -type ip -vlnv xilinx.com:ip:dds_compiler:6.0 dds_compiler_1khx
set_property -dict [list \
  CONFIG.Has_Phase_Out false \
  CONFIG.Latency 8 \
  CONFIG.M_DATA_Has_TUSER Not_Required \
  CONFIG.Noise_Shaping Auto \
  CONFIG.Output_Frequency1 0.001 \
  CONFIG.Output_Width 16 \
  CONFIG.PINC1 101001111100 \
  CONFIG.Phase_Width 28 \
  CONFIG.Spurious_Free_Dynamic_Range 95 \
] [get_bd_cells dds_compiler_1khx]
create_bd_cell -type ip -vlnv xilinx.com:ip:xlslice:1.0 xlslice_0
set_property -dict {CONFIG.DIN_FROM 31 CONFIG.DIN_TO 16} [get_bd_cells xlslice_0]
create_bd_cell -type ip -vlnv xilinx.com:ip:xlslice:1.0 xlslice_1
set_property -dict {CONFIG.DIN_FROM 15 CONFIG.DIN_TO 0} [get_bd_cells xlslice_1]
create_bd_cell -type module -reference i2s_transmitter_16 i2s_transmitter_16_0
create_bd_cell -type ip -vlnv xilinx.com:ip:util_vector_logic:2.0 util_vector_logic_1
set_property -dict {CONFIG.C_OPERATION not CONFIG.C_SIZE 1} [get_bd_cells util_vector_logic_1]

# ---- hierarchy /HDMI ----
current_bd_instance /HDMI
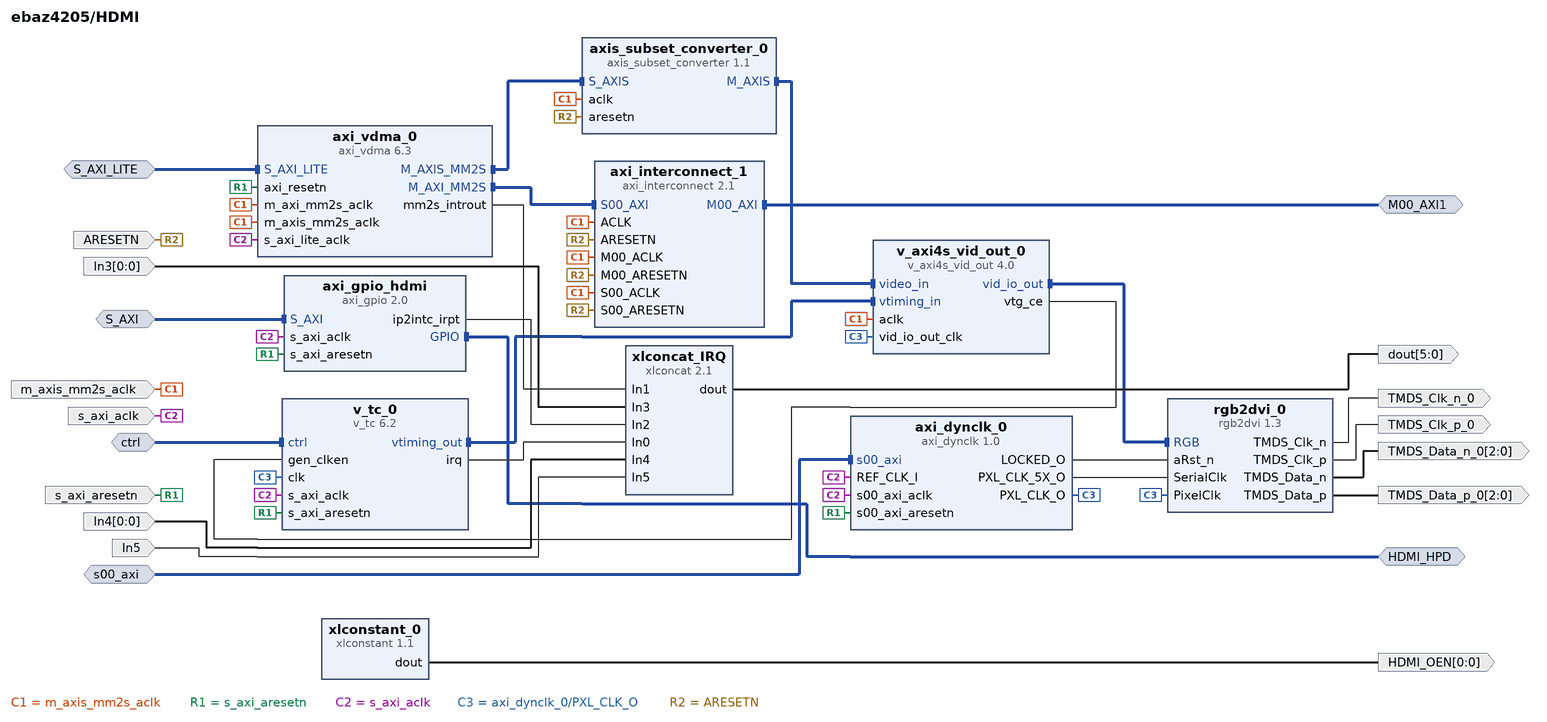
[diagram p10: block diagram inside /HDMI]
create_bd_intf_pin -mode Slave -vlnv xilinx.com:interface:aximm_rtl:1.0 S_AXI_LITE
create_bd_intf_pin -mode Slave -vlnv xilinx.com:interface:aximm_rtl:1.0 s00_axi
create_bd_intf_pin -mode Slave -vlnv xilinx.com:interface:aximm_rtl:1.0 S_AXI
create_bd_intf_pin -mode Master -vlnv xilinx.com:interface:gpio_rtl:1.0 HDMI_HPD
create_bd_intf_pin -mode Slave -vlnv xilinx.com:interface:aximm_rtl:1.0 ctrl
create_bd_intf_pin -mode Master -vlnv xilinx.com:interface:aximm_rtl:1.0 M00_AXI1
create_bd_pin -dir I -type clk s_axi_aclk
create_bd_pin -dir I -type clk m_axis_mm2s_aclk
create_bd_pin -dir I -type rst s_axi_aresetn
create_bd_pin -dir O -from 0 -to 0 HDMI_OEN
create_bd_pin -dir I -type rst ARESETN
create_bd_pin -dir O TMDS_Clk_p_0
create_bd_pin -dir O TMDS_Clk_n_0
create_bd_pin -dir O -from 2 -to 0 TMDS_Data_p_0
create_bd_pin -dir O -from 2 -to 0 TMDS_Data_n_0
create_bd_pin -dir O -from 5 -to 0 dout
create_bd_pin -dir I -from 0 -to 0 -type intr In3
create_bd_pin -dir I -from 0 -to 0 -type intr In4
create_bd_pin -dir I -type intr In5

create_bd_cell -type ip -vlnv digilentinc.com:ip:axi_dynclk:1.0 axi_dynclk_0
create_bd_cell -type ip -vlnv xilinx.com:ip:axi_vdma:6.3 axi_vdma_0
set_property -dict [list \
  CONFIG.c_include_s2mm 0 \
  CONFIG.c_m_axis_mm2s_tdata_width 32 \
  CONFIG.c_mm2s_linebuffer_depth 4096 \
  CONFIG.c_mm2s_max_burst_length 16 \
  CONFIG.c_num_fstores 3 \
] [get_bd_cells axi_vdma_0]
create_bd_cell -type ip -vlnv xilinx.com:ip:axis_subset_converter:1.1 axis_subset_converter_0
set_property -dict [list \
  CONFIG.M_HAS_TKEEP 1 \
  CONFIG.M_HAS_TLAST 1 \
  CONFIG.M_TDATA_NUM_BYTES 3 \
  CONFIG.M_TUSER_WIDTH 1 \
  CONFIG.S_HAS_TKEEP 1 \
  CONFIG.S_HAS_TLAST 1 \
  CONFIG.S_TDATA_NUM_BYTES 4 \
  CONFIG.S_TUSER_WIDTH 1 \
  CONFIG.TDATA_REMAP {tdata[23:16],tdata[7:0],tdata[15:8]} \
  CONFIG.TKEEP_REMAP {tkeep[2:0]} \
  CONFIG.TLAST_REMAP {tlast[0]} \
  CONFIG.TUSER_REMAP {tuser[0:0]} \
] [get_bd_cells axis_subset_converter_0]
create_bd_cell -type ip -vlnv xilinx.com:ip:v_tc:6.2 v_tc_0
set_property -dict {CONFIG.enable_detection false} [get_bd_cells v_tc_0]
create_bd_cell -type ip -vlnv xilinx.com:ip:xlconstant:1.1 xlconstant_0
create_bd_cell -type ip -vlnv xilinx.com:ip:xlconcat:2.1 xlconcat_IRQ
set_property -dict {CONFIG.NUM_PORTS 6} [get_bd_cells xlconcat_IRQ]
create_bd_cell -type ip -vlnv xilinx.com:ip:axi_interconnect:2.1 axi_interconnect_1
set_property -dict [list \
  CONFIG.NUM_MI 1 \
  CONFIG.NUM_SI 1 \
  CONFIG.S00_HAS_DATA_FIFO 2 \
  CONFIG.S00_HAS_REGSLICE 4 \
] [get_bd_cells axi_interconnect_1]
create_bd_cell -type ip -vlnv xilinx.com:ip:v_axi4s_vid_out:4.0 v_axi4s_vid_out_0
set_property -dict {CONFIG.C_ADDR_WIDTH 12 CONFIG.C_HAS_ASYNC_CLK 1 CONFIG.C_VTG_MASTER_SLAVE 1} [get_bd_cells v_axi4s_vid_out_0]
create_bd_cell -type ip -vlnv digilentinc.com:ip:rgb2dvi:1.3 rgb2dvi_0
set_property -dict {CONFIG.kClkRange 2 CONFIG.kGenerateSerialClk false CONFIG.kRstActiveHigh false} [get_bd_cells rgb2dvi_0]
create_bd_cell -type ip -vlnv xilinx.com:ip:axi_gpio:2.0 axi_gpio_hdmi
set_property -dict {CONFIG.C_ALL_INPUTS 1 CONFIG.C_GPIO_WIDTH 1 CONFIG.C_INTERRUPT_PRESENT 1} [get_bd_cells axi_gpio_hdmi]

# ---- hierarchy /DDC_FT ----
current_bd_instance /DDC_FT
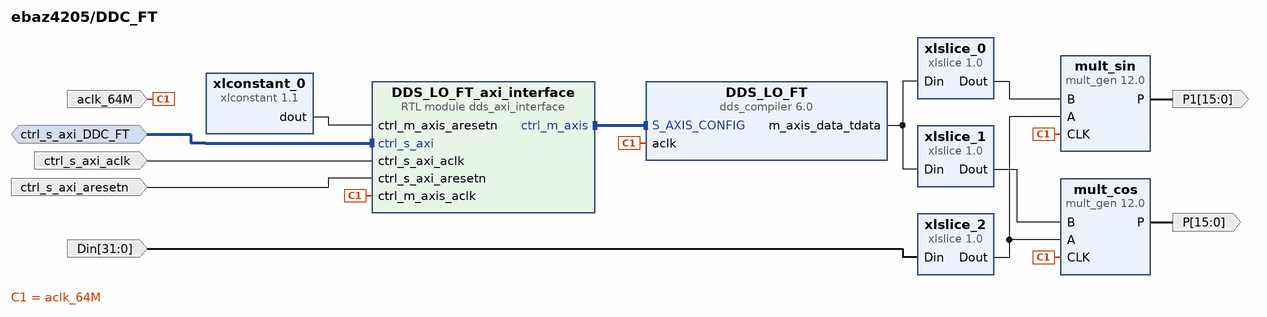
[diagram p11: block diagram inside /DDC_FT]
create_bd_intf_pin -mode Slave -vlnv xilinx.com:interface:aximm_rtl:1.0 ctrl_s_axi_DDC_FT
create_bd_pin -dir I -from 31 -to 0 Din
create_bd_pin -dir I -type clk aclk_64M
create_bd_pin -dir I -type rst ctrl_s_axi_aresetn
create_bd_pin -dir I -type clk ctrl_s_axi_aclk
create_bd_pin -dir O -from 15 -to 0 -type data P
create_bd_pin -dir O -from 15 -to 0 -type data P1

create_bd_cell -type ip -vlnv xilinx.com:ip:mult_gen:12.0 mult_cos
set_property -dict [list \
  CONFIG.OutputWidthHigh 26 \
  CONFIG.OutputWidthLow 11 \
  CONFIG.PortAWidth 12 \
  CONFIG.PortBWidth 16 \
  CONFIG.Use_Custom_Output_Width true \
] [get_bd_cells mult_cos]
create_bd_cell -type ip -vlnv xilinx.com:ip:mult_gen:12.0 mult_sin
set_property -dict [list \
  CONFIG.OutputWidthHigh 26 \
  CONFIG.OutputWidthLow 11 \
  CONFIG.PortAWidth 12 \
  CONFIG.PortBWidth 16 \
  CONFIG.Use_Custom_Output_Width true \
] [get_bd_cells mult_sin]
create_bd_cell -type ip -vlnv xilinx.com:ip:xlslice:1.0 xlslice_0
set_property -dict {CONFIG.DIN_FROM 31 CONFIG.DIN_TO 16} [get_bd_cells xlslice_0]
create_bd_cell -type ip -vlnv xilinx.com:ip:xlslice:1.0 xlslice_1
set_property -dict {CONFIG.DIN_FROM 15} [get_bd_cells xlslice_1]
create_bd_cell -type ip -vlnv xilinx.com:ip:xlslice:1.0 xlslice_2
set_property -dict {CONFIG.DIN_FROM 31 CONFIG.DIN_TO 20} [get_bd_cells xlslice_2]
create_bd_cell -type module -reference dds_axi_interface DDS_LO_FT_axi_interface
create_bd_cell -type ip -vlnv xilinx.com:ip:dds_compiler:6.0 DDS_LO_FT
set_property -dict [list \
  CONFIG.DATA_Has_TLAST Not_Required \
  CONFIG.DDS_Clock_Rate 64 \
  CONFIG.Frequency_Resolution 1 \
  CONFIG.Has_Phase_Out false \
  CONFIG.Latency 9 \
  CONFIG.M_DATA_Has_TUSER Not_Required \
  CONFIG.Noise_Shaping Auto \
  CONFIG.Output_Frequency1 10.2 \
  CONFIG.Output_Width 16 \
  CONFIG.PINC1 101000110011001100110011 \
  CONFIG.Parameter_Entry System_Parameters \
  CONFIG.Phase_Increment Programmable \
  CONFIG.Phase_Width 26 \
  CONFIG.Phase_offset Fixed \
  CONFIG.S_PHASE_Has_TUSER Not_Required \
  CONFIG.Spurious_Free_Dynamic_Range 95 \
] [get_bd_cells DDS_LO_FT]
create_bd_cell -type ip -vlnv xilinx.com:ip:xlconstant:1.1 xlconstant_0

# ---- hierarchy /FILTER_FT ----
current_bd_instance /FILTER_FT
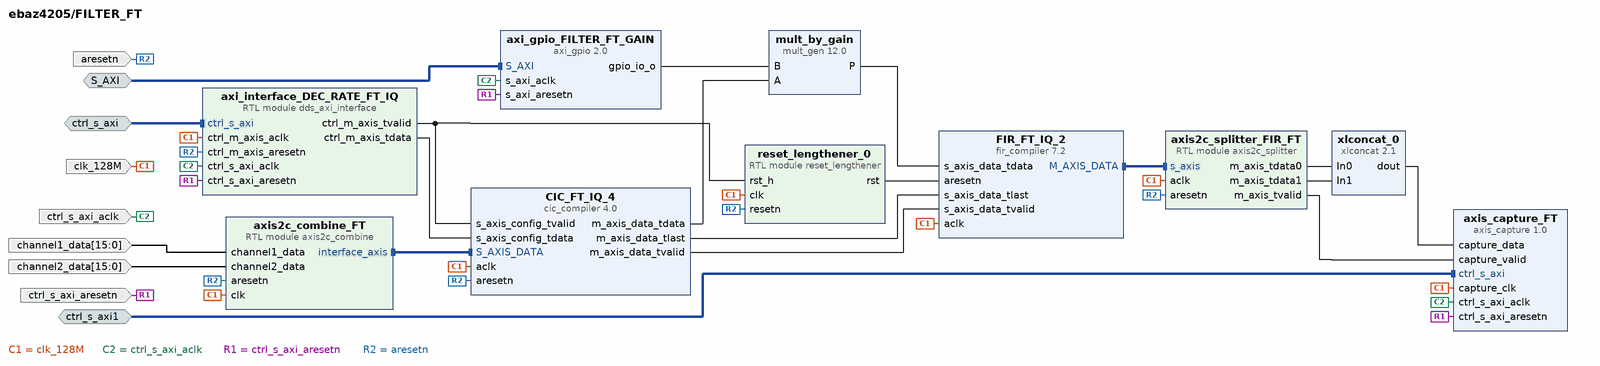
[diagram p12: block diagram inside /FILTER_FT]
create_bd_intf_pin -mode Slave -vlnv xilinx.com:interface:aximm_rtl:1.0 ctrl_s_axi
create_bd_intf_pin -mode Slave -vlnv xilinx.com:interface:aximm_rtl:1.0 ctrl_s_axi1
create_bd_intf_pin -mode Slave -vlnv xilinx.com:interface:aximm_rtl:1.0 S_AXI
create_bd_pin -dir I -type clk clk_128M
create_bd_pin -dir I -type rst aresetn
create_bd_pin -dir I -from 15 -to 0 channel1_data
create_bd_pin -dir I -from 15 -to 0 channel2_data
create_bd_pin -dir I -type clk ctrl_s_axi_aclk
create_bd_pin -dir I -type rst ctrl_s_axi_aresetn

create_bd_cell -type module -reference dds_axi_interface axi_interface_DEC_RATE_FT_IQ
set_property -dict {CONFIG.C_CTRL_M_AXIS_TDATA_WIDTH 16} [get_bd_cells axi_interface_DEC_RATE_FT_IQ]
create_bd_cell -type ip -vlnv xilinx.com:ip:cic_compiler:4.0 CIC_FT_IQ_4
set_property -dict [list \
  CONFIG.Clock_Frequency 128 \
  CONFIG.Filter_Type Decimation \
  CONFIG.Fixed_Or_Initial_Rate 4 \
  CONFIG.HAS_ARESETN true \
  CONFIG.Input_Data_Width 16 \
  CONFIG.Input_Sample_Frequency 64 \
  CONFIG.Maximum_Rate 8192 \
  CONFIG.Minimum_Rate 4 \
  CONFIG.Number_Of_Channels 2 \
  CONFIG.Number_Of_Stages 6 \
  CONFIG.Output_Data_Width 16 \
  CONFIG.Quantization Truncation \
  CONFIG.RateSpecification Sample_Period \
  CONFIG.SamplePeriod 1 \
  CONFIG.Sample_Rate_Changes Programmable \
  CONFIG.Use_Xtreme_DSP_Slice true \
] [get_bd_cells CIC_FT_IQ_4]
create_bd_cell -type ip -vlnv xilinx.com:ip:fir_compiler:7.2 FIR_FT_IQ_2
set_property -dict [list \
  CONFIG.Clock_Frequency 128 \
  CONFIG.CoefficientSource COE_File \
  CONFIG.Coefficient_File ../../../../../../matlab/mycoefile.coe \
  CONFIG.Coefficient_Fractional_Bits 0 \
  CONFIG.Coefficient_Sets 1 \
  CONFIG.Coefficient_Sign Signed \
  CONFIG.Coefficient_Structure Inferred \
  CONFIG.Coefficient_Width 16 \
  CONFIG.ColumnConfig 28 \
  CONFIG.DATA_Has_TLAST Vector_Framing \
  CONFIG.Data_Width 16 \
  CONFIG.Decimation_Rate 2 \
  CONFIG.Filter_Architecture Systolic_Multiply_Accumulate \
  CONFIG.Filter_Type Decimation \
  CONFIG.Has_ARESETn true \
  CONFIG.Interpolation_Rate 1 \
  CONFIG.M_DATA_Has_TUSER Not_Required \
  CONFIG.Number_Channels 2 \
  CONFIG.Output_Rounding_Mode Truncate_LSBs \
  CONFIG.Output_Width 16 \
  CONFIG.Quantization Maximize_Dynamic_Range \
  CONFIG.RateSpecification Frequency_Specification \
  CONFIG.Reset_Data_Vector false \
  CONFIG.S_DATA_Has_TUSER Not_Required \
  CONFIG.Sample_Frequency 64 \
  CONFIG.Select_Pattern All \
  CONFIG.Zero_Pack_Factor 1 \
] [get_bd_cells FIR_FT_IQ_2]
create_bd_cell -type ip -vlnv xilinx.com:ip:mult_gen:12.0 mult_by_gain
set_property -dict [list \
  CONFIG.Multiplier_Construction Use_Mults \
  CONFIG.OptGoal Area \
  CONFIG.OutputWidthHigh 15 \
  CONFIG.PipeStages 0 \
  CONFIG.PortAType Signed \
  CONFIG.PortAWidth 16 \
  CONFIG.PortBWidth 16 \
  CONFIG.Use_Custom_Output_Width true \
] [get_bd_cells mult_by_gain]
create_bd_cell -type ip -vlnv xilinx.com:user:axis_capture:1.0 axis_capture_FT
create_bd_cell -type ip -vlnv xilinx.com:ip:xlconcat:2.1 xlconcat_0
set_property -dict {CONFIG.IN0_WIDTH 16 CONFIG.IN1_WIDTH 16} [get_bd_cells xlconcat_0]
create_bd_cell -type module -reference axis2c_combine axis2c_combine_FT
create_bd_cell -type module -reference reset_lengthener reset_lengthener_0
create_bd_cell -type ip -vlnv xilinx.com:ip:axi_gpio:2.0 axi_gpio_FILTER_FT_GAIN
set_property -dict [list \
  CONFIG.C_ALL_OUTPUTS 1 \
  CONFIG.C_DOUT_DEFAULT 0x00000001 \
  CONFIG.C_GPIO_WIDTH 16 \
] [get_bd_cells axi_gpio_FILTER_FT_GAIN]
create_bd_cell -type module -reference axis2c_splitter axis2c_splitter_FIR_FT

# ---- hierarchy /PS2 ----
current_bd_instance /PS2
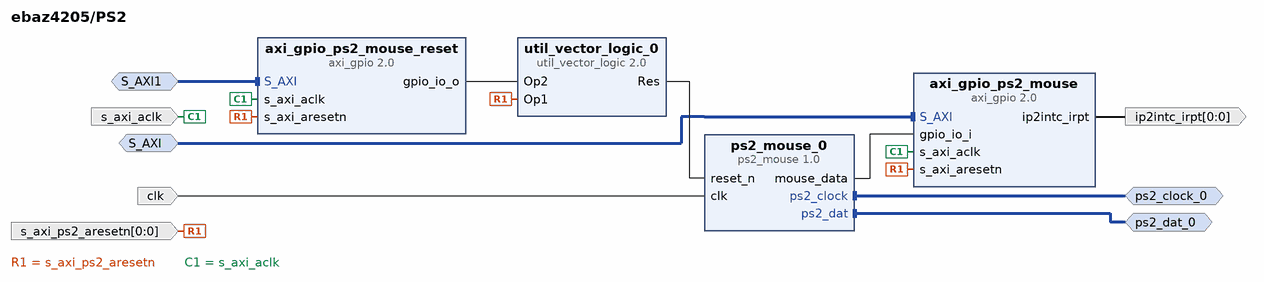
[diagram p13: block diagram inside /PS2]
create_bd_intf_pin -mode Master -vlnv xilinx.com:interface:gpio_rtl:1.0 ps2_dat_0
create_bd_intf_pin -mode Master -vlnv xilinx.com:interface:gpio_rtl:1.0 ps2_clock_0
create_bd_intf_pin -mode Slave -vlnv xilinx.com:interface:aximm_rtl:1.0 S_AXI
create_bd_intf_pin -mode Slave -vlnv xilinx.com:interface:aximm_rtl:1.0 S_AXI1
create_bd_pin -dir I -type clk clk
create_bd_pin -dir I -from 0 -to 0 s_axi_ps2_aresetn
create_bd_pin -dir I -type clk s_axi_aclk
create_bd_pin -dir O -from 0 -to 0 -type intr ip2intc_irpt

create_bd_cell -type ip -vlnv xilinx.com:user:ps2_mouse:1.0 ps2_mouse_0
create_bd_cell -type ip -vlnv xilinx.com:ip:util_vector_logic:2.0 util_vector_logic_0
set_property -dict {CONFIG.C_SIZE 1} [get_bd_cells util_vector_logic_0]
create_bd_cell -type ip -vlnv xilinx.com:ip:axi_gpio:2.0 axi_gpio_ps2_mouse
set_property -dict [list \
  CONFIG.C_ALL_INPUTS 1 \
  CONFIG.C_GPIO_WIDTH 32 \
  CONFIG.C_INTERRUPT_PRESENT 1 \
  CONFIG.C_IS_DUAL 0 \
] [get_bd_cells axi_gpio_ps2_mouse]
create_bd_cell -type ip -vlnv xilinx.com:ip:axi_gpio:2.0 axi_gpio_ps2_mouse_reset
set_property -dict [list \
  CONFIG.C_ALL_OUTPUTS 1 \
  CONFIG.C_DOUT_DEFAULT 0x00000001 \
  CONFIG.C_GPIO_WIDTH 1 \
] [get_bd_cells axi_gpio_ps2_mouse_reset]

# ---- hierarchy /SSB_demodulator ----
current_bd_instance /SSB_demodulator
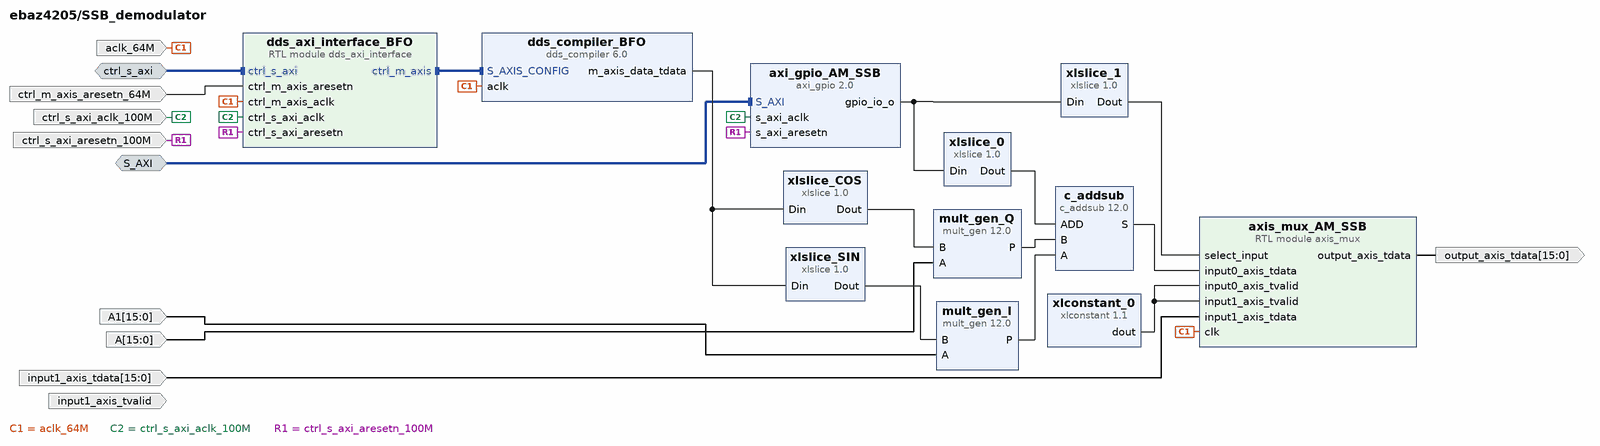
[diagram p14: block diagram inside /SSB_demodulator]
create_bd_intf_pin -mode Slave -vlnv xilinx.com:interface:aximm_rtl:1.0 ctrl_s_axi
create_bd_intf_pin -mode Slave -vlnv xilinx.com:interface:aximm_rtl:1.0 S_AXI
create_bd_pin -dir I -from 15 -to 0 input1_axis_tdata
create_bd_pin -dir O -from 15 -to 0 output_axis_tdata
create_bd_pin -dir I -type clk ctrl_s_axi_aclk_100M
create_bd_pin -dir I -type rst ctrl_s_axi_aresetn_100M
create_bd_pin -dir I -type clk aclk_64M
create_bd_pin -dir I -type rst ctrl_m_axis_aresetn_64M
create_bd_pin -dir I -from 15 -to 0 -type data A
create_bd_pin -dir I -from 15 -to 0 -type data A1
create_bd_pin -dir I input1_axis_tvalid

create_bd_cell -type ip -vlnv xilinx.com:ip:mult_gen:12.0 mult_gen_Q
set_property -dict [list \
  CONFIG.Multiplier_Construction Use_Mults \
  CONFIG.OutputWidthHigh 29 \
  CONFIG.OutputWidthLow 14 \
  CONFIG.PipeStages 0 \
  CONFIG.PortAWidth 16 \
  CONFIG.PortBWidth 16 \
  CONFIG.Use_Custom_Output_Width true \
] [get_bd_cells mult_gen_Q]
create_bd_cell -type ip -vlnv xilinx.com:ip:mult_gen:12.0 mult_gen_I
set_property -dict [list \
  CONFIG.Multiplier_Construction Use_Mults \
  CONFIG.OptGoal Area \
  CONFIG.OutputWidthHigh 29 \
  CONFIG.OutputWidthLow 14 \
  CONFIG.PipeStages 0 \
  CONFIG.PortAType Signed \
  CONFIG.PortAWidth 16 \
  CONFIG.PortBWidth 16 \
  CONFIG.Use_Custom_Output_Width true \
] [get_bd_cells mult_gen_I]
create_bd_cell -type ip -vlnv xilinx.com:ip:c_addsub:12.0 c_addsub
set_property -dict [list \
  CONFIG.A_Width 16 \
  CONFIG.Add_Mode Add_Subtract \
  CONFIG.B_Value 0000000000000000 \
  CONFIG.B_Width 16 \
  CONFIG.CE false \
  CONFIG.Latency 0 \
  CONFIG.Out_Width 16 \
] [get_bd_cells c_addsub]
create_bd_cell -type ip -vlnv xilinx.com:ip:dds_compiler:6.0 dds_compiler_BFO
set_property -dict [list \
  CONFIG.DATA_Has_TLAST Not_Required \
  CONFIG.DDS_Clock_Rate 64 \
  CONFIG.Frequency_Resolution 1 \
  CONFIG.Has_Phase_Out false \
  CONFIG.Latency 8 \
  CONFIG.M_DATA_Has_TUSER Not_Required \
  CONFIG.Noise_Shaping Auto \
  CONFIG.Output_Frequency1 0.01 \
  CONFIG.Output_Width 16 \
  CONFIG.PINC1 10100011110101 \
  CONFIG.Phase_Increment Programmable \
  CONFIG.Phase_Width 26 \
  CONFIG.S_PHASE_Has_TUSER Not_Required \
  CONFIG.Spurious_Free_Dynamic_Range 95 \
] [get_bd_cells dds_compiler_BFO]
create_bd_cell -type ip -vlnv xilinx.com:ip:xlslice:1.0 xlslice_COS
set_property -dict {CONFIG.DIN_FROM 15} [get_bd_cells xlslice_COS]
create_bd_cell -type ip -vlnv xilinx.com:ip:xlslice:1.0 xlslice_SIN
set_property -dict {CONFIG.DIN_FROM 31 CONFIG.DIN_TO 16} [get_bd_cells xlslice_SIN]
create_bd_cell -type module -reference dds_axi_interface dds_axi_interface_BFO
create_bd_cell -type module -reference axis_mux axis_mux_AM_SSB
create_bd_cell -type ip -vlnv xilinx.com:ip:xlslice:1.0 xlslice_1
set_property -dict {CONFIG.DIN_FROM 1 CONFIG.DIN_TO 1 CONFIG.DIN_WIDTH 2} [get_bd_cells xlslice_1]
create_bd_cell -type ip -vlnv xilinx.com:ip:xlslice:1.0 xlslice_0
set_property -dict {CONFIG.DIN_WIDTH 2} [get_bd_cells xlslice_0]
create_bd_cell -type ip -vlnv xilinx.com:ip:xlconstant:1.1 xlconstant_0
create_bd_cell -type ip -vlnv xilinx.com:ip:axi_gpio:2.0 axi_gpio_AM_SSB
set_property -dict {CONFIG.C_ALL_OUTPUTS 1 CONFIG.C_DOUT_DEFAULT 0x00000001 CONFIG.C_GPIO_WIDTH 2} [get_bd_cells axi_gpio_AM_SSB]

# ---- hierarchy /Audio_DMA ----
current_bd_instance /Audio_DMA
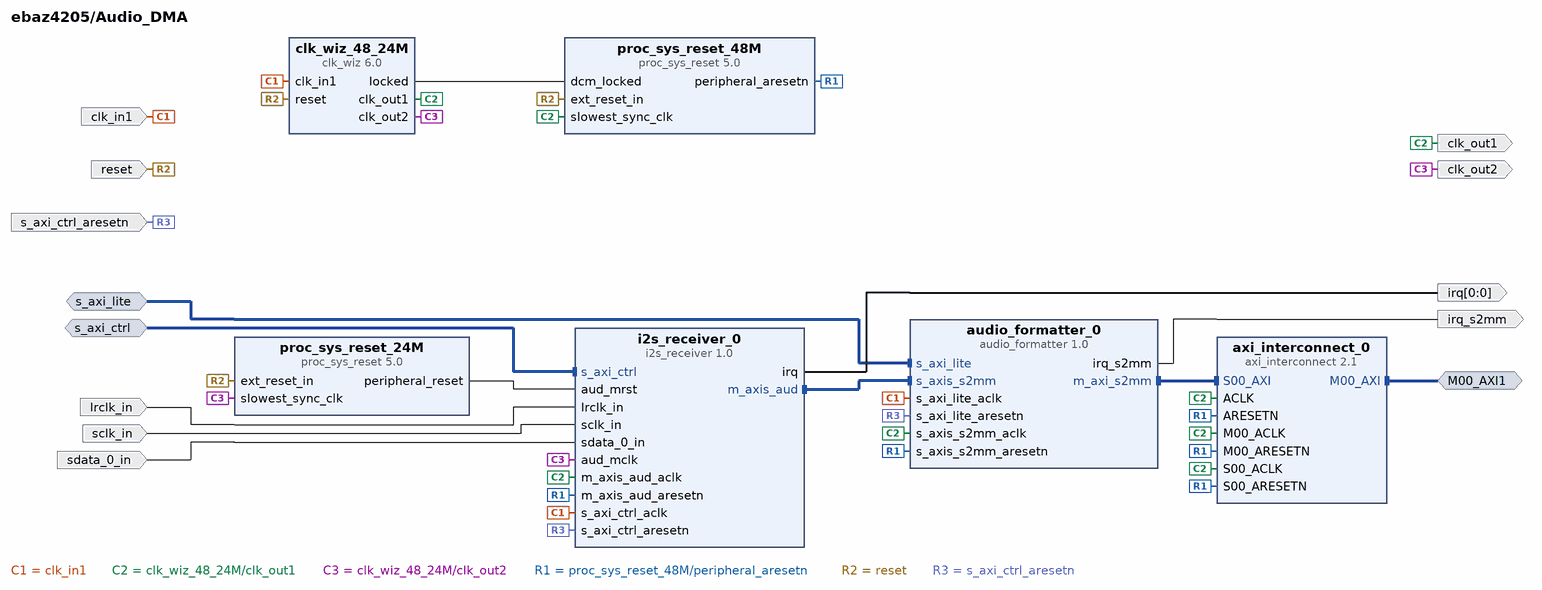
[diagram p15: block diagram inside /Audio_DMA]
create_bd_intf_pin -mode Slave -vlnv xilinx.com:interface:aximm_rtl:1.0 s_axi_lite
create_bd_intf_pin -mode Slave -vlnv xilinx.com:interface:aximm_rtl:1.0 s_axi_ctrl
create_bd_intf_pin -mode Master -vlnv xilinx.com:interface:aximm_rtl:1.0 M00_AXI1
create_bd_pin -dir I -type clk clk_in1
create_bd_pin -dir O -type clk clk_out1
create_bd_pin -dir O -type intr irq_s2mm
create_bd_pin -dir I -type rst reset
create_bd_pin -dir I sdata_0_in
create_bd_pin -dir O -from 0 -to 0 -type intr irq
create_bd_pin -dir I -type rst s_axi_ctrl_aresetn
create_bd_pin -dir O -type clk clk_out2
create_bd_pin -dir I lrclk_in
create_bd_pin -dir I sclk_in

create_bd_cell -type ip -vlnv xilinx.com:ip:audio_formatter:1.0 audio_formatter_0
set_property -dict [list \
  CONFIG.C_INCLUDE_MM2S 0 \
  CONFIG.C_INCLUDE_S2MM 1 \
  CONFIG.C_S2MM_ADDR_WIDTH 64 \
  CONFIG.C_S2MM_DATAFORMAT 1 \
] [get_bd_cells audio_formatter_0]
create_bd_cell -type ip -vlnv xilinx.com:ip:axi_interconnect:2.1 axi_interconnect_0
set_property -dict {CONFIG.NUM_MI 1} [get_bd_cells axi_interconnect_0]
create_bd_cell -type ip -vlnv xilinx.com:ip:clk_wiz:6.0 clk_wiz_48_24M
set_property -dict [list \
  CONFIG.CLKOUT1_DRIVES BUFG \
  CONFIG.CLKOUT1_JITTER 281.382 \
  CONFIG.CLKOUT1_PHASE_ERROR 301.601 \
  CONFIG.CLKOUT1_REQUESTED_OUT_FREQ 48 \
  CONFIG.CLKOUT2_DRIVES BUFG \
  CONFIG.CLKOUT2_JITTER 320.117 \
  CONFIG.CLKOUT2_PHASE_ERROR 301.601 \
  CONFIG.CLKOUT2_REQUESTED_OUT_FREQ 24 \
  CONFIG.CLKOUT2_USED true \
  CONFIG.CLKOUT3_DRIVES BUFG \
  CONFIG.CLKOUT4_DRIVES BUFG \
  CONFIG.CLKOUT5_DRIVES BUFG \
  CONFIG.CLKOUT6_DRIVES BUFG \
  CONFIG.CLKOUT7_DRIVES BUFG \
  CONFIG.FEEDBACK_SOURCE FDBK_AUTO \
  CONFIG.MMCM_BANDWIDTH OPTIMIZED \
  CONFIG.MMCM_CLKFBOUT_MULT_F 48 \
  CONFIG.MMCM_CLKIN1_PERIOD 10.000 \
  CONFIG.MMCM_CLKIN2_PERIOD 10.000 \
  CONFIG.MMCM_CLKOUT0_DIVIDE_F 20 \
  CONFIG.MMCM_CLKOUT1_DIVIDE 40 \
  CONFIG.MMCM_COMPENSATION ZHOLD \
  CONFIG.MMCM_DIVCLK_DIVIDE 5 \
  CONFIG.NUM_OUT_CLKS 2 \
  CONFIG.PRIMITIVE PLL \
] [get_bd_cells clk_wiz_48_24M]
create_bd_cell -type ip -vlnv xilinx.com:ip:i2s_receiver:1.0 i2s_receiver_0
set_property -dict {CONFIG.C_DEPTH 256 CONFIG.C_DWIDTH 16 CONFIG.C_IS_MASTER 0} [get_bd_cells i2s_receiver_0]
create_bd_cell -type ip -vlnv xilinx.com:ip:proc_sys_reset:5.0 proc_sys_reset_48M
create_bd_cell -type ip -vlnv xilinx.com:ip:proc_sys_reset:5.0 proc_sys_reset_24M

# ---- connections ----

current_bd_instance /PS
connect_bd_intf_net [get_bd_intf_pins M_AXI_GP0] [get_bd_intf_pins processing_system7_0/M_AXI_GP0]
connect_bd_intf_net [get_bd_intf_pins S_AXI_HP0] [get_bd_intf_pins processing_system7_0/S_AXI_HP0]
connect_bd_intf_net [get_bd_intf_pins S_AXI_HP2] [get_bd_intf_pins processing_system7_0/S_AXI_HP1]
connect_bd_intf_net [get_bd_intf_pins DDR] [get_bd_intf_pins processing_system7_0/DDR]
connect_bd_intf_net [get_bd_intf_pins FIXED_IO] [get_bd_intf_pins processing_system7_0/FIXED_IO]
connect_bd_intf_net [get_bd_intf_pins MDIO_ETHERNET_0_0] [get_bd_intf_pins processing_system7_0/MDIO_ETHERNET_0]
connect_bd_net [get_bd_pins DivideBy2_50MHz/clk_out] [get_bd_pins clk_out]
connect_bd_net [get_bd_pins DivideBy4_25MHz/clk_out] [get_bd_pins CLK_25M]
connect_bd_net -net ENET0_GMII_RX_CLK_0_1 [get_bd_pins ENET0_GMII_RX_CLK_0] \
  [get_bd_pins processing_system7_0/ENET0_GMII_RX_CLK] [get_bd_pins rst_ENET0_GMII_RX_CLK_0_100M/slowest_sync_clk]
connect_bd_net -net ENET0_GMII_RX_DV_0_1 [get_bd_pins ENET0_GMII_RX_DV_0] [get_bd_pins processing_system7_0/ENET0_GMII_RX_DV]
connect_bd_net -net ENET0_GMII_TX_CLK_0_1 [get_bd_pins ENET0_GMII_TX_CLK_0] [get_bd_pins processing_system7_0/ENET0_GMII_TX_CLK]
connect_bd_net [get_bd_pins IRQ_F2P] [get_bd_pins processing_system7_0/IRQ_F2P]
connect_bd_net -net In0_0_1 [get_bd_pins enet0_gmii_rxd] [get_bd_pins xlconcat_0/In0]
connect_bd_net [get_bd_pins S_AXI_HP1_ACLK] [get_bd_pins processing_system7_0/S_AXI_HP1_ACLK]
connect_bd_net [get_bd_pins clk_wiz_128M/clk_out1] [get_bd_pins FCLK_CLK1_128M] [get_bd_pins proc_sys_reset_128M/slowest_sync_clk]
connect_bd_net [get_bd_pins clk_wiz_384M/clk_out1] [get_bd_pins clk_out_384M] [get_bd_pins proc_sys_reset_384M/slowest_sync_clk]
connect_bd_net -net proc_sys_reset_0_peripheral_aresetn [get_bd_pins proc_sys_reset_0_100M/peripheral_aresetn] \
  [get_bd_pins ARESETN] [get_bd_pins DivideBy2_50MHz/resetn] [get_bd_pins rst_ENET0_GMII_RX_CLK_0_100M/ext_reset_in]
connect_bd_net -net proc_sys_reset_0_peripheral_reset [get_bd_pins proc_sys_reset_0_100M/peripheral_reset] [get_bd_pins peripheral_reset]
connect_bd_net [get_bd_pins proc_sys_reset_384M/peripheral_aresetn] [get_bd_pins aresetn_384M]
connect_bd_net [get_bd_pins processing_system7_0/ENET0_GMII_TXD] [get_bd_pins xlslice_0/Din]
connect_bd_net [get_bd_pins processing_system7_0/ENET0_GMII_TX_EN] [get_bd_pins ENET0_GMII_TX_EN_0]
connect_bd_net [get_bd_pins processing_system7_0/FCLK_CLK0] \
  [get_bd_pins FCLK_CLK0_100M] [get_bd_pins DivideBy4_25MHz/clk] [get_bd_pins DivideBy2_50MHz/clk] \
  [get_bd_pins proc_sys_reset_0_100M/slowest_sync_clk] [get_bd_pins processing_system7_0/M_AXI_GP0_ACLK] \
  [get_bd_pins clk_wiz_384M/clk_in1] [get_bd_pins clk_wiz_128M/clk_in1]
connect_bd_net [get_bd_pins processing_system7_0/FCLK_CLK1] [get_bd_pins ADC_clk_64M] [get_bd_pins rst_ps7_0_64M/slowest_sync_clk]
connect_bd_net -net processing_system7_0_FCLK_CLK2_140M [get_bd_pins processing_system7_0/FCLK_CLK2] \
  [get_bd_pins FCLK_CLK2_140M] [get_bd_pins processing_system7_0/S_AXI_HP0_ACLK] \
  [get_bd_pins rst_ps7_0_140M/slowest_sync_clk]
connect_bd_net [get_bd_pins processing_system7_0/FCLK_RESET0_N] \
  [get_bd_pins proc_sys_reset_0_100M/ext_reset_in] [get_bd_pins proc_sys_reset_128M/ext_reset_in] \
  [get_bd_pins rst_ps7_0_140M/ext_reset_in] [get_bd_pins rst_ps7_0_64M/ext_reset_in] \
  [get_bd_pins proc_sys_reset_384M/ext_reset_in] [get_bd_pins clk_wiz_128M/resetn] [get_bd_pins clk_wiz_384M/resetn]
connect_bd_net [get_bd_pins rst_ps7_0_140M/peripheral_aresetn] [get_bd_pins peripheral_aresetn1]
connect_bd_net -net rst_ps7_0_64M_peripheral_aresetn [get_bd_pins proc_sys_reset_128M/peripheral_aresetn] [get_bd_pins peripheral_aresetn_128M]
connect_bd_net [get_bd_pins rst_ps7_0_64M/peripheral_aresetn] [get_bd_pins peripheral_aresetn]
connect_bd_net [get_bd_pins xlconcat_0/dout] [get_bd_pins processing_system7_0/ENET0_GMII_RXD]
connect_bd_net [get_bd_pins xlconstant_0/dout] [get_bd_pins DivideBy4_25MHz/resetn]
connect_bd_net [get_bd_pins xlslice_0/Dout] [get_bd_pins enet0_gmii_txd]
